# Altium project NucleoClone.PrjPcb
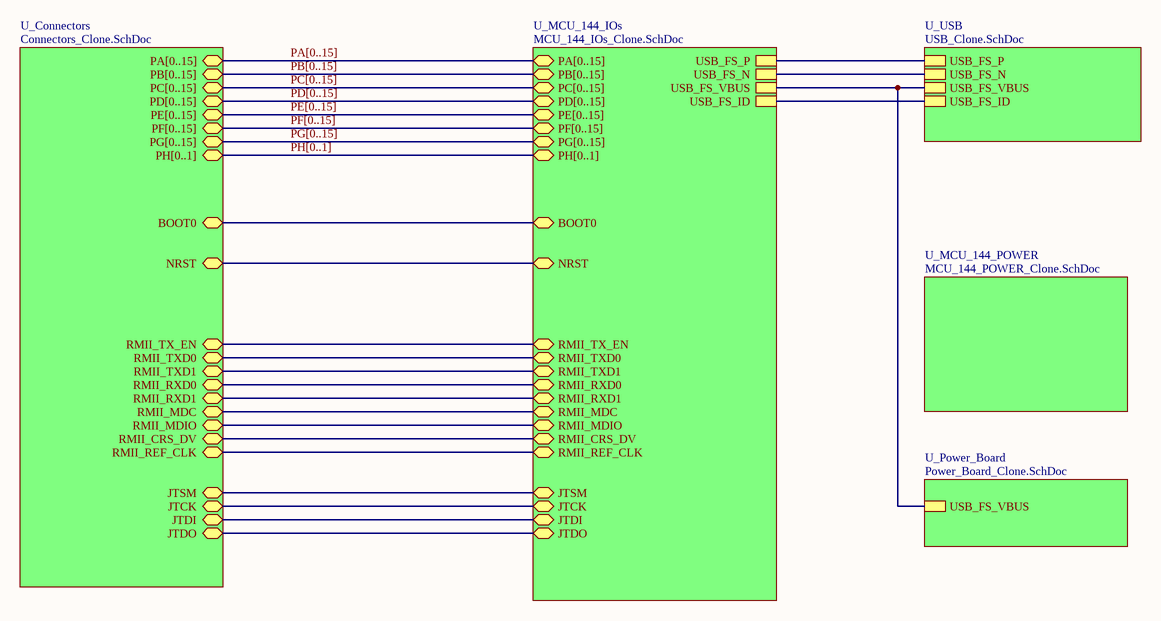
[diagram p0: NucleoClone_Top.SchDoc]
Board_Assembly_Revision: 01; Board_Document_Date: 17-DEC-2018; Board_Name: NUCLEO 144 H7 LEGACY; Board_PCB_Revision: C; Board_Reference: MB1364
6 sheets, 121 parts. Net scope: hierarchical (ports join the sheet entries above them; power ports are global).
Board file: NucleoClone.PcbDoc
Sheets:
  NucleoClone_Top.SchDoc
    U_Connectors = Connectors_Clone.SchDoc
    U_Power_Board = Power_Board_Clone.SchDoc
    U_MCU_144_IOs = MCU_144_IOs_Clone.SchDoc
    U_MCU_144_POWER = MCU_144_POWER_Clone.SchDoc
    U_USB = USB_Clone.SchDoc

## Sheet NucleoClone_Top.SchDoc: mb1319 Top: hierarchical view
size A4; Date: Not used; ApprovedBy: Not used; CheckedBy: Not used; Author: Not used; CompanyName: STMicroelectronics; DrawnBy: Not used; Engineer: Not used; Organization: Not used; Address1: Not used; Address2: Not used; Address3: Not used; Address4: Not used; DocumentNumber: 2; Revision: Not used; SheetNumber: 2; SheetTotal: 9; CurrentTime: Not used; CurrentDate: Not used; Time: Not used; DocumentFullPathAndName: Not used; DocumentName: Not used; ModifiedDate: Not used; ImagePath: Not used; ProjectName: Not used; Application_BuildNumber: Not used

### Sub-sheets
U_Connectors = Connectors_Clone.SchDoc: PA[0..15] (bidir), PB[0..15] (bidir), PC[0..15] (bidir), PD[0..15] (bidir), PE[0..15] (bidir), PH[0..1] (bidir), PF[0..15] (bidir), PG[0..15] (bidir), JTSM (bidir), JTCK (bidir), JTDI (bidir), JTDO (bidir), RMII_TX_EN (bidir), RMII_TXD0 (bidir), RMII_TXD1 (bidir), RMII_RXD0 (bidir), RMII_RXD1 (bidir), RMII_MDC (bidir), RMII_MDIO (bidir), RMII_CRS_DV (bidir), RMII_REF_CLK (bidir), NRST (bidir), BOOT0 (bidir)
U_MCU_144_IOs = MCU_144_IOs_Clone.SchDoc: NRST (bidir), BOOT0 (bidir), RMII_TX_EN (bidir), RMII_MDC (bidir), RMII_TXD0 (bidir), RMII_TXD1 (bidir), RMII_REF_CLK (bidir), RMII_RXD1 (bidir), RMII_MDIO (bidir), RMII_CRS_DV (bidir), RMII_RXD0 (bidir), USB_FS_N, USB_FS_P, USB_FS_VBUS, USB_FS_ID, PA[0..15] (bidir), PB[0..15] (bidir), PC[0..15] (bidir), PD[0..15] (bidir), PE[0..15] (bidir), PH[0..1] (bidir), PG[0..15] (bidir), PF[0..15] (bidir), JTSM (bidir), JTCK (bidir), JTDI (bidir), JTDO (bidir)
U_MCU_144_POWER = MCU_144_POWER_Clone.SchDoc: no entries
U_Power_Board = Power_Board_Clone.SchDoc: USB_FS_VBUS
U_USB = USB_Clone.SchDoc: USB_FS_VBUS, USB_FS_N, USB_FS_P, USB_FS_ID

### Nets
BOOT0: sheet U_Connectors/BOOT0, sheet U_MCU_144_IOs/BOOT0
JTDO: sheet U_Connectors/JTDO, sheet U_MCU_144_IOs/JTDO
NRST: sheet U_Connectors/NRST, sheet U_MCU_144_IOs/NRST
PA13: sheet U_Connectors/JTSM, sheet U_MCU_144_IOs/JTSM
PA14: sheet U_Connectors/JTCK, sheet U_MCU_144_IOs/JTCK
PA15: sheet U_Connectors/JTDI, sheet U_MCU_144_IOs/JTDI
RMII_CRS_DV: sheet U_Connectors/RMII_CRS_DV, sheet U_MCU_144_IOs/RMII_CRS_DV
RMII_MDC: sheet U_Connectors/RMII_MDC, sheet U_MCU_144_IOs/RMII_MDC
RMII_MDIO: sheet U_Connectors/RMII_MDIO, sheet U_MCU_144_IOs/RMII_MDIO
RMII_REF_CLK: sheet U_Connectors/RMII_REF_CLK, sheet U_MCU_144_IOs/RMII_REF_CLK
RMII_RXD0: sheet U_Connectors/RMII_RXD0, sheet U_MCU_144_IOs/RMII_RXD0
RMII_RXD1: sheet U_Connectors/RMII_RXD1, sheet U_MCU_144_IOs/RMII_RXD1
RMII_TX_EN: sheet U_Connectors/RMII_TX_EN, sheet U_MCU_144_IOs/RMII_TX_EN
RMII_TXD0: sheet U_Connectors/RMII_TXD0, sheet U_MCU_144_IOs/RMII_TXD0
RMII_TXD1: sheet U_Connectors/RMII_TXD1, sheet U_MCU_144_IOs/RMII_TXD1
USB_FS_ID: sheet U_MCU_144_IOs/USB_FS_ID, sheet U_USB/USB_FS_ID
USB_FS_N: sheet U_MCU_144_IOs/USB_FS_N, sheet U_USB/USB_FS_N
USB_FS_P: sheet U_MCU_144_IOs/USB_FS_P, sheet U_USB/USB_FS_P
USB_FS_VBUS: sheet U_Power_Board/USB_FS_VBUS, sheet U_MCU_144_IOs/USB_FS_VBUS, sheet U_USB/USB_FS_VBUS

### Buses and harness runs
bus PA[0..15] = sheet U_Connectors/PA[0..15] = sheet U_MCU_144_IOs/PA[0..15]
bus PB[0..15] = sheet U_Connectors/PB[0..15] = sheet U_MCU_144_IOs/PB[0..15]
bus PC[0..15] = sheet U_Connectors/PC[0..15] = sheet U_MCU_144_IOs/PC[0..15]
bus PD[0..15] = sheet U_Connectors/PD[0..15] = sheet U_MCU_144_IOs/PD[0..15]
bus PE[0..15] = sheet U_Connectors/PE[0..15] = sheet U_MCU_144_IOs/PE[0..15]
bus PF[0..15] = sheet U_Connectors/PF[0..15] = sheet U_MCU_144_IOs/PF[0..15]
bus PG[0..15] = sheet U_Connectors/PG[0..15] = sheet U_MCU_144_IOs/PG[0..15]
bus PH[0..1] = sheet U_Connectors/PH[0..1] = sheet U_MCU_144_IOs/PH[0..1]

### Notes on the sheet
- Title:
- Project:
- Size:
- Revision:
- Variant:
- A4
- -
- Date:
- Reference:
- Sheet:
- of

## Sheet Connectors_Clone.SchDoc: Connectors
size A3; Date: Not used; ApprovedBy: Not used; CheckedBy: Not used; Author: Not used; CompanyName: STMicroelectronics; DrawnBy: Not used; Engineer: Not used; Organization: Not used; Address1: Not used; Address2: Not used; Address3: Not used; Address4: Not used; DocumentNumber: 5; Revision: Not used; SheetNumber: 5; SheetTotal: 9; CurrentTime: Not used; CurrentDate: Not used; Time: Not used; DocumentFullPathAndName: Not used; DocumentName: Not used; ModifiedDate: Not used; ImagePath: Not used; ProjectName: Not used; Application_BuildNumber: Not used
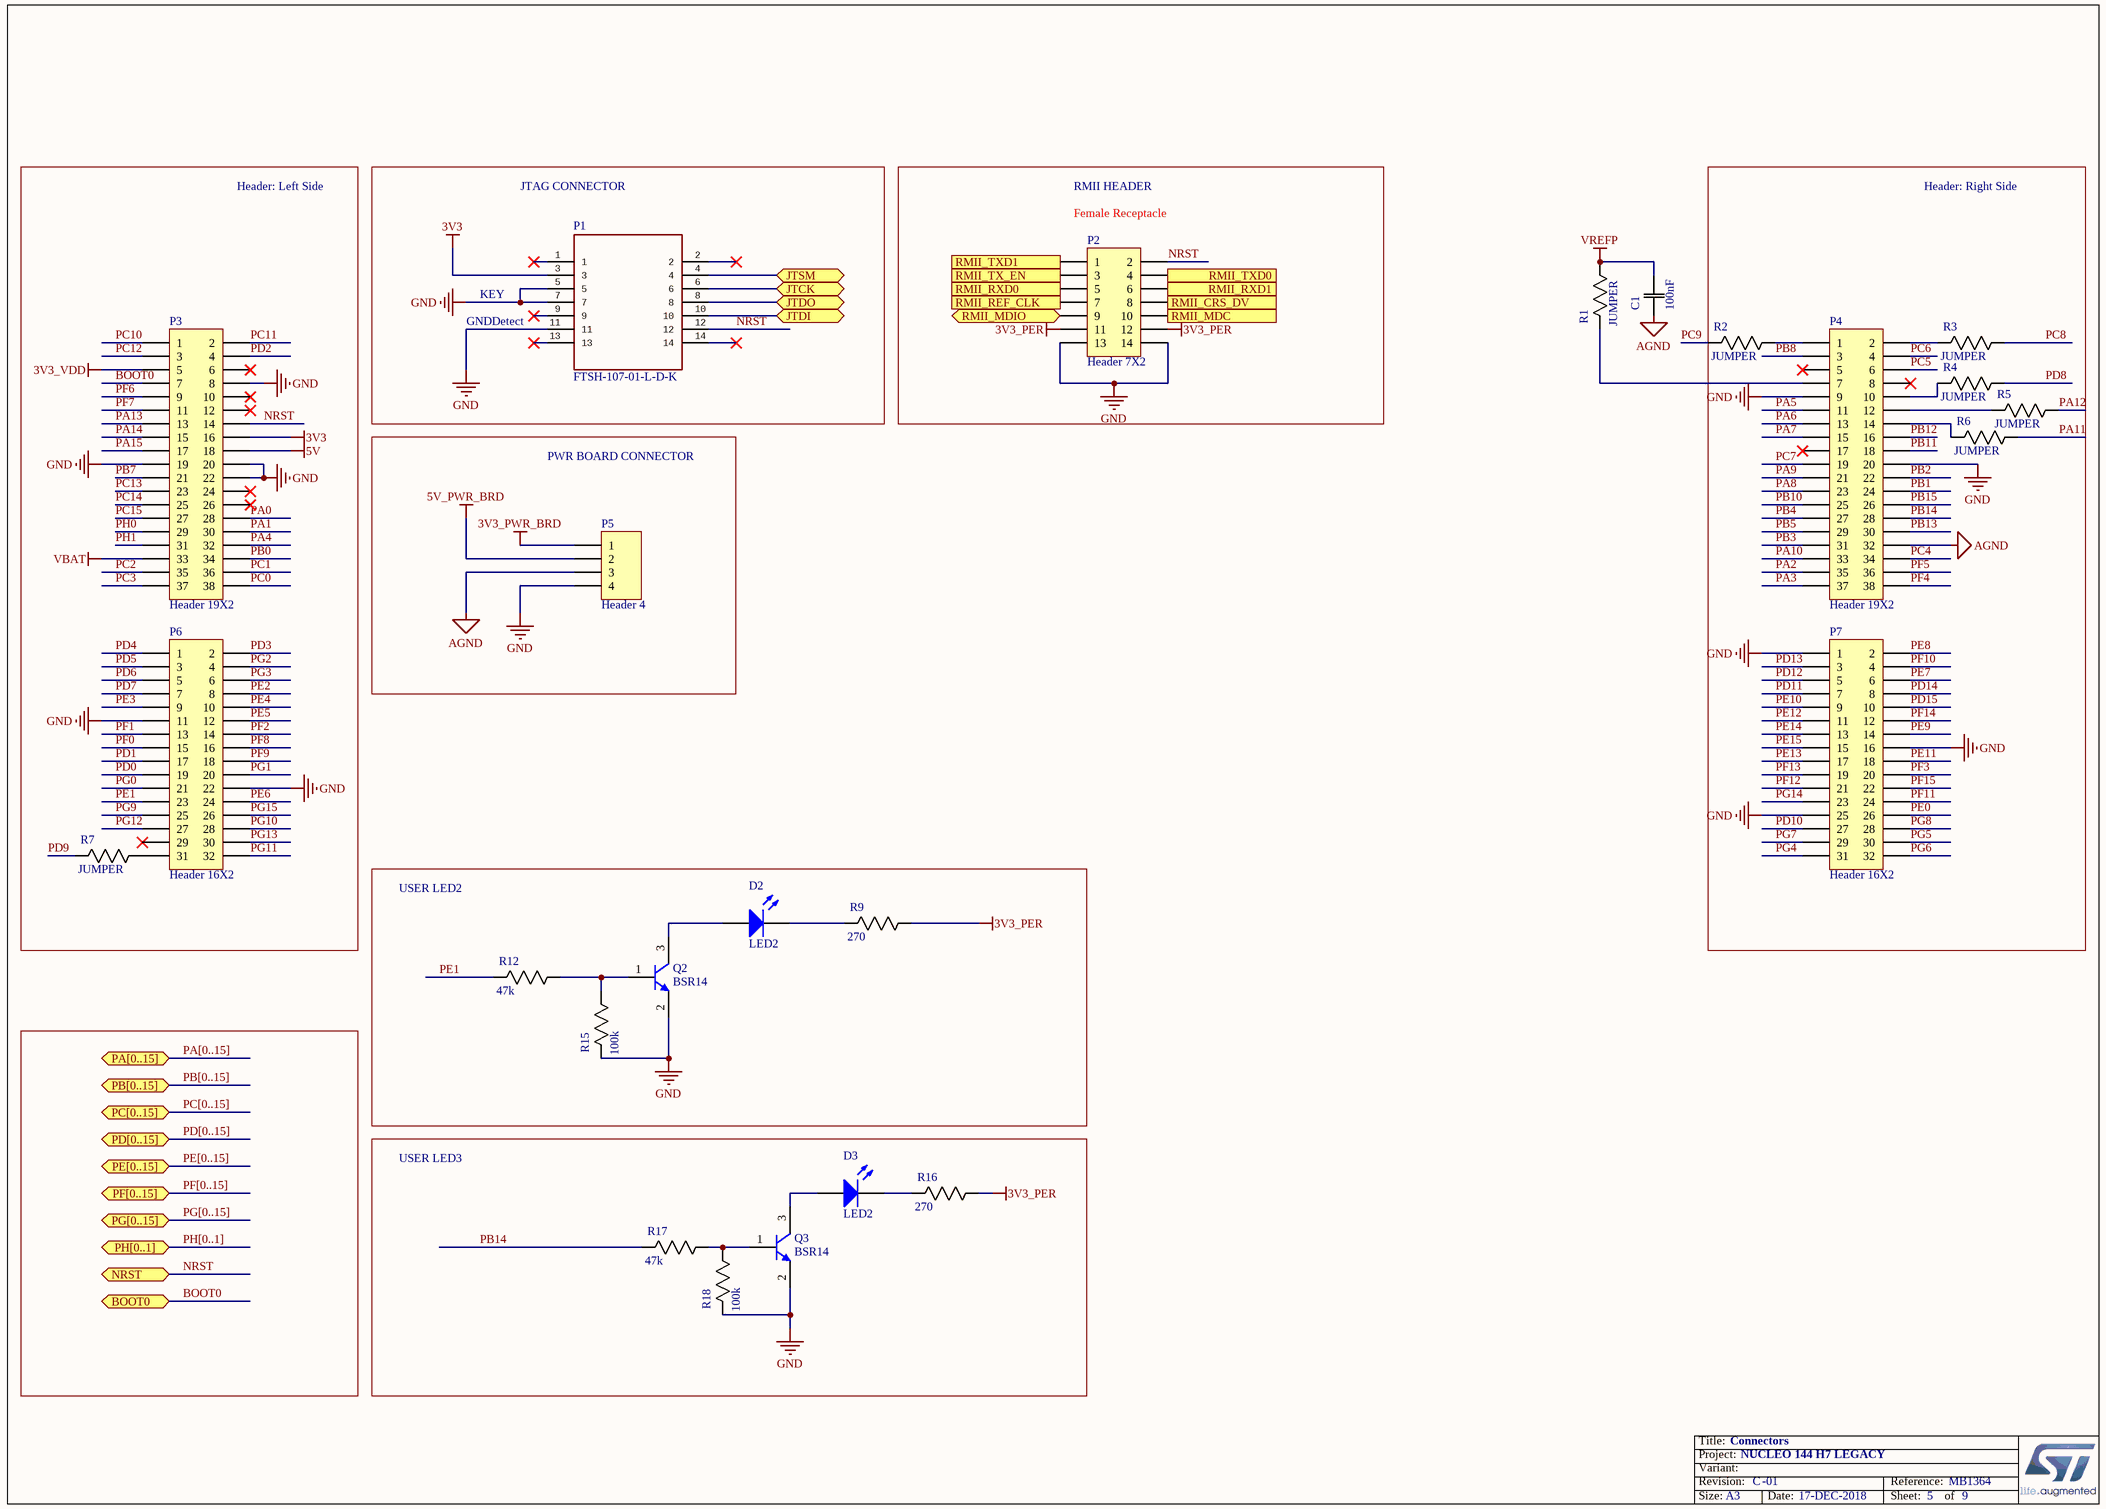
[diagram p1: Connectors_Clone.SchDoc]

### Parts
C1  100nF  [0805]
D2  LED2  [3.2X1.6X1.1]
D3  LED2  [3.2X1.6X1.1]
P1  FTSH-107-01-L-D-K  [CN HDR JTAG]
P2  Header 7X2  [HDR2X7]
P3  Header 19X2  [HDR2X19]
P4  Header 19X2  [HDR2X19]
P5  Header 4  [HDR1X4]
P6  Header 16X2  [HDR2X16]
P7  Header 16X2  [HDR2X16]
Q2  BSR14  [ONSC-SOT-23-3-318-08_V]
Q3  BSR14  [ONSC-SOT-23-3-318-08_V]
R1  JUMPER  [0805]
R2  JUMPER  [0805]
R3  JUMPER  [0805]
R4  JUMPER  [0805]
R5  JUMPER  [0805]
R6  JUMPER  [0805]
R7  JUMPER  [0805]
R9  270  [0805]
R12  47k  [0805]
R15  100k  [0805]
R16  270  [0805]
R17  47k  [0805]
R18  100k  [0805]

### Blocks framed on the sheet
Header: Left Side: P3 P6 R7
Header: Right Side: P4 P7 R2-R6
PWR BOARD CONNECTOR: P5
USER LED2: D2 Q2 R9 R12 R15
USER LED3: D3 Q3 R16-R18

### Ports
BOOT0 (bidir), JTCK (bidir), JTDI (bidir), JTDO (bidir), JTSM (bidir), NRST (bidir), PA[0..15] (bidir), PB[0..15] (bidir), PC[0..15] (bidir), PD[0..15] (bidir), PE[0..15] (bidir), PF[0..15] (bidir), PG[0..15] (bidir), PH[0..1] (bidir), RMII_CRS_DV (out), RMII_MDC (in), RMII_MDIO (bidir), RMII_REF_CLK (in), RMII_RXD0 (out), RMII_RXD1 (out), RMII_TX_EN (in), RMII_TXD0 (in), RMII_TXD1 (in)

### Nets
3V3: P1.3 P3.16
3V3_PER: P2.11 P2.12 R9.1(R1) R16.1(R1)
3V3_PWR_BRD: P5.1
3V3_VDD: P3.5
5V: P3.18
5V_PWR_BRD: P5.2
AGND: C1.1(C1) P4.32 P5.3
GND: P1.5 P1.7 P1.11 P2.13 P2.14 P3.8 P3.19 P3.20 P3.22 P4.9 P4.20 P5.4 P6.11 P6.22 P7.1 P7.16 P7.25 Q2.2(E) Q3.2(E) R15.2(R2) R18.2(R2)
VBAT: P3.33
VREFP: C1.2(C2) R1.1(R1)
BOOT0: P3.7 ; port BOOT0
JTDO: P1.8 ; port JTDO
NRST: P1.12 P2.2 P3.14 ; port NRST
PA0: P3.28
PA1: P3.30
PA2: P4.35
PA3: P4.37
PA4: P3.32
PA5: P4.11
PA6: P4.13
PA7: P4.15
PA8: P4.23
PA9: P4.21
PA10: P4.33
PA11: R6.1(R1)
PA12: R5.1(R1)
PA13: P1.4 P3.13 ; port JTSM
PA14: P1.6 P3.15 ; port JTCK
PA15: P1.10 P3.17 ; port JTDI
PB0: P3.34
PB1: P4.24
PB2: P4.22
PB3: P4.31
PB4: P4.27
PB5: P4.29
PB7: P3.21
PB8: P4.3
PB10: P4.25
PB11: P4.18
PB12: P4.16
PB13: P4.30
PB14: P4.28 R17.2(R2)
PB15: P4.26
PC0: P3.38
PC1: P3.36
PC2: P3.35
PC3: P3.37
PC4: P4.34
PC5: P4.6
PC6: P4.4
PC7: P4.19
PC8: R3.1(R1)
PC9: R2.2(R2)
PC10: P3.1
PC11: P3.2
PC12: P3.3
PC13: P3.23
PC14: P3.25
PC15: P3.27
PD0: P6.19
PD1: P6.17
PD2: P3.4
PD3: P6.2
PD4: P6.1
PD5: P6.3
PD6: P6.5
PD7: P6.7
PD8: R4.1(R1)
PD9: R7.2(R2)
PD10: P7.27
PD11: P7.7
PD12: P7.5
PD13: P7.3
PD14: P7.8
PD15: P7.10
PE0: P7.26
PE1: P6.23 R12.2(R2)
PE2: P6.8
PE3: P6.9
PE4: P6.10
PE5: P6.12
PE6: P6.24
PE7: P7.6
PE8: P7.2
PE9: P7.14
PE10: P7.9
PE11: P7.18
PE12: P7.11
PE13: P7.17
PE14: P7.13
PE15: P7.15
PF0: P6.15
PF1: P6.13
PF2: P6.14
PF3: P7.20
PF4: P4.38
PF5: P4.36
PF6: P3.9
PF7: P3.11
PF8: P6.16
PF9: P6.18
PF10: P7.4
PF11: P7.24
PF12: P7.21
PF13: P7.19
PF14: P7.12
PF15: P7.22
PG0: P6.21
PG1: P6.20
PG2: P6.4
PG3: P6.6
PG4: P7.31
PG5: P7.30
PG6: P7.32
PG7: P7.29
PG8: P7.28
PG9: P6.25
PG10: P6.28
PG11: P6.32
PG12: P6.27
PG13: P6.30
PG14: P7.23
PG15: P6.26
PH0: P3.29
PH1: P3.31
RMII_CRS_DV: P2.8 ; port RMII_CRS_DV
RMII_MDC: P2.10 ; port RMII_MDC
RMII_MDIO: P2.9 ; port RMII_MDIO
RMII_REF_CLK: P2.7 ; port RMII_REF_CLK
RMII_RXD0: P2.5 ; port RMII_RXD0
RMII_RXD1: P2.6 ; port RMII_RXD1
RMII_TX_EN: P2.3 ; port RMII_TX_EN
RMII_TXD0: P2.4 ; port RMII_TXD0
RMII_TXD1: P2.1 ; port RMII_TXD1
NetD2_1: D2.1(A) Q2.3(C)
NetD2_2: D2.2(K) R9.2(R2)
NetD3_1: D3.1(A) Q3.3(C)
NetD3_2: D3.2(K) R16.2(R2)
NetP4_1: P4.1 R2.1(R1)
NetP4_2: P4.2 R3.2(R2)
NetP4_7: P4.7 R1.2(R2)
NetP4_10: P4.10 R4.2(R2)
NetP4_12: P4.12 R5.2(R2)
NetP4_14: P4.14 R6.2(R2)
NetP6_31: P6.31 R7.1(R1)
NetQ2_1: Q2.1(B) R12.1(R1) R15.1(R1)
NetQ3_1: Q3.1(B) R17.1(R1) R18.1(R1)

Not connected (* = marked no-connect by the designer): P1 1* 2* 9* 13* 14*; P3 6* 10* 12* 24* 26*; P4 5* 8* 17*; P6 29*

### Buses and harness runs
bus PA[0..15] = port PA[0..15]
bus PB[0..15] = port PB[0..15]
bus PC[0..15] = port PC[0..15]
bus PD[0..15] = port PD[0..15]
bus PE[0..15] = port PE[0..15]
bus PF[0..15] = port PF[0..15]
bus PG[0..15] = port PG[0..15]
bus PH[0..1] = port PH[0..1]

### Notes on the sheet
- JTAG CONNECTOR
- RMII HEADER
- (near P2) Female Receptacle
- KEY
- (near P1) GNDDetect
- Title:
- Project:
- Size:
- Revision:
- Variant:
- A3
- -
- Date:
- Reference:
- Sheet:
- of

### Library data of the parts
C1 = CAP 100nF 0805: CAP CER 0.1UF 50V X7R 0805; MP: CC0805KRX7R9BB104; MF: Yageo; Tolerance: 10%; Package: 0805; Price: 0,119 CAD; Value: 100nF; Digikey: 311-1140-1-ND; Digikey Link: https://www.digikey.ca/products/en?keywords=311-1140-1-ND; Rating: 50V
D2 = LED GREEN SMD: Typical RED, GREEN, YELLOW, AMBER GaAs LED; MF: Lite-On Inc.; MP: LTST-C191KGKT; Rating: 2V; Digikey: 160-1446-1-ND; Digikey Link: https://www.digikey.ca/products/en?keywords=160-1446-1-ND; Package: 0603
D3 = LED RED SMD: Typical RED, GREEN, YELLOW, AMBER GaAs LED; MF: Lite-On Inc.; MP: LTST-C190CKT; Rating: 1.8V; Digikey: 160-1181-1-ND; Digikey Link: https://www.digikey.ca/products/en?keywords=160-1181-1-ND; Package: 0603
P1 = CN HDR JTAG: Connector Header Through Hole 14 position 0.050" (1.27mm); MF: Samtec Inc.; Rating: 3.4A; ComponentLink1Description: Digikey; ComponentLink1URL: https://www.digikey.ca/product-detail/en/samtec-inc/FTSH-107-01-L-D-K/612-FTSH-107-01-L-D-K-ND/6693516; ComponentLink2Description: Datasheet; ComponentLink2URL: https://www.digikey.ca/en/datasheets/samtecinc/samtec-inc-ftsh-1xx-xx-xx-d-xx-xx-mkt; Digikey: 612-FTSH-107-01-L-D-K-ND; Digikey Link: https://www.digikey.ca/product-detail/en/samtec-inc/FTSH-107-01-L-D-K/612-FTSH-107-01-L-D-K-ND/6693516; MP: FTSH-107-01-L-D-K; Price: 5.14000 CAD
P2 = Header 7X2: Header, 7-Pin, Dual row; LatestRevisionDate: 17-Jul-2002; LatestRevisionNote: Re-released for DXP Platform.; Publisher: Altium Limited
P3 P4 = Header 19X2: Header, 19-Pin, Dual row; LatestRevisionDate: 17-Jul-2002; LatestRevisionNote: Re-released for DXP Platform.; Publisher: Altium Limited
P5 = Header 4: Header, 4-Pin; LatestRevisionDate: 17-Jul-2002; LatestRevisionNote: Re-released for DXP Platform.; Publisher: Altium Limited
P6 P7 = Header 16X2: Header, 16-Pin, Dual row; LatestRevisionDate: 17-Jul-2002; LatestRevisionNote: Re-released for DXP Platform.; Publisher: Altium Limited
Q2 Q3 = CMP-1048-00605-1: Bipolar (BJT) Transistor NPN 40V 800mA 300MHz 350mW Surface Mount SOT-23-3; ComponentLink1Description: Manufacturer URL; ComponentLink3Description: Package Specification; ComponentLink2URL: http://www.onsemi.com/pub_link/Collateral/BSS64LT1-D.PDF; ComponentLink1URL: http://www.onsemi.com/; ComponentLink2Description: Datasheet; ComponentLink3URL: http://www.onsemi.cn/pub_link/Collateral/318-08.PDF; Digikey: BSR14TR-ND
R1-R7 = RES 0 0805: RES SMD 0 OHM JUMPER 1/8W 0805; MP: RC0805JR-070RL; MF: Yageo; Value: 0; Rating: 0.125W; Digikey: 311-0.0ARCT-ND; Price: 0.058 CAD; Package: 0805; Digikey Link: https://www.digikey.ca/products/en?keywords=311-0.0ARCT-ND
R9 R16 = RES 270 0805: RES SMD 270 OHM 5% 1/8W 0805; MP: RC0805JR-07270RL; MF: Yageo; Rating: 0.125W; Digikey: 311-270ARCT-ND; Price: 0.054 CAD; Package: 0805; Value: 270; Digikey Link: https://www.digikey.ca/product-detail/en/yageo/RC0805JR-07270RL/311-270ARCT-ND/731238
R12 R17 = RES 47k 0805: RES SMD 47K OHM 1% 1/8W 0805; MP: RC0805FR-0747KL; MF: Yageo; Rating: 0.125W; Digikey: 311-47.0KCRCT-ND; Price: 0.061 CAD; Package: 0805; Value: 47k; Digikey Link: https://www.digikey.ca/product-detail/en/yageo/RC0805FR-0747KL/311-47.0KCRCT-ND/730920; Tolerance: 1%
R15 R18 = RES 100k 0805: RES SMD 100K OHM 1% 1/8W 0805; MP: RC0805FR-07100KL; MF: Yageo; Rating: 0.125W; Digikey: 311-100KCRCT-ND; Price: 0.058 CAD; Package: 0805; Value: 100k; Digikey Link: https://www.digikey.ca/products/en?keywords=311-100KCRCT-ND; Tolerance: 1%

## Sheet Power_Board_Clone.SchDoc: MAIN POWER 5V / 3V3 / 1V8
size A4; Date: Not used; ApprovedBy: Not used; CheckedBy: Not used; Author: Not used; CompanyName: STMicroelectronics; DrawnBy: Not used; Engineer: Not used; Organization: Not used; Address1: Not used; Address2: Not used; Address3: Not used; Address4: Not used; DocumentNumber: 9; Revision: Not used; SheetNumber: 8; SheetTotal: 9; CurrentTime: Not used; CurrentDate: Not used; Time: Not used; DocumentFullPathAndName: Not used; DocumentName: Not used; ModifiedDate: Not used; ImagePath: Not used; ProjectName: Not used; Application_BuildNumber: Not used
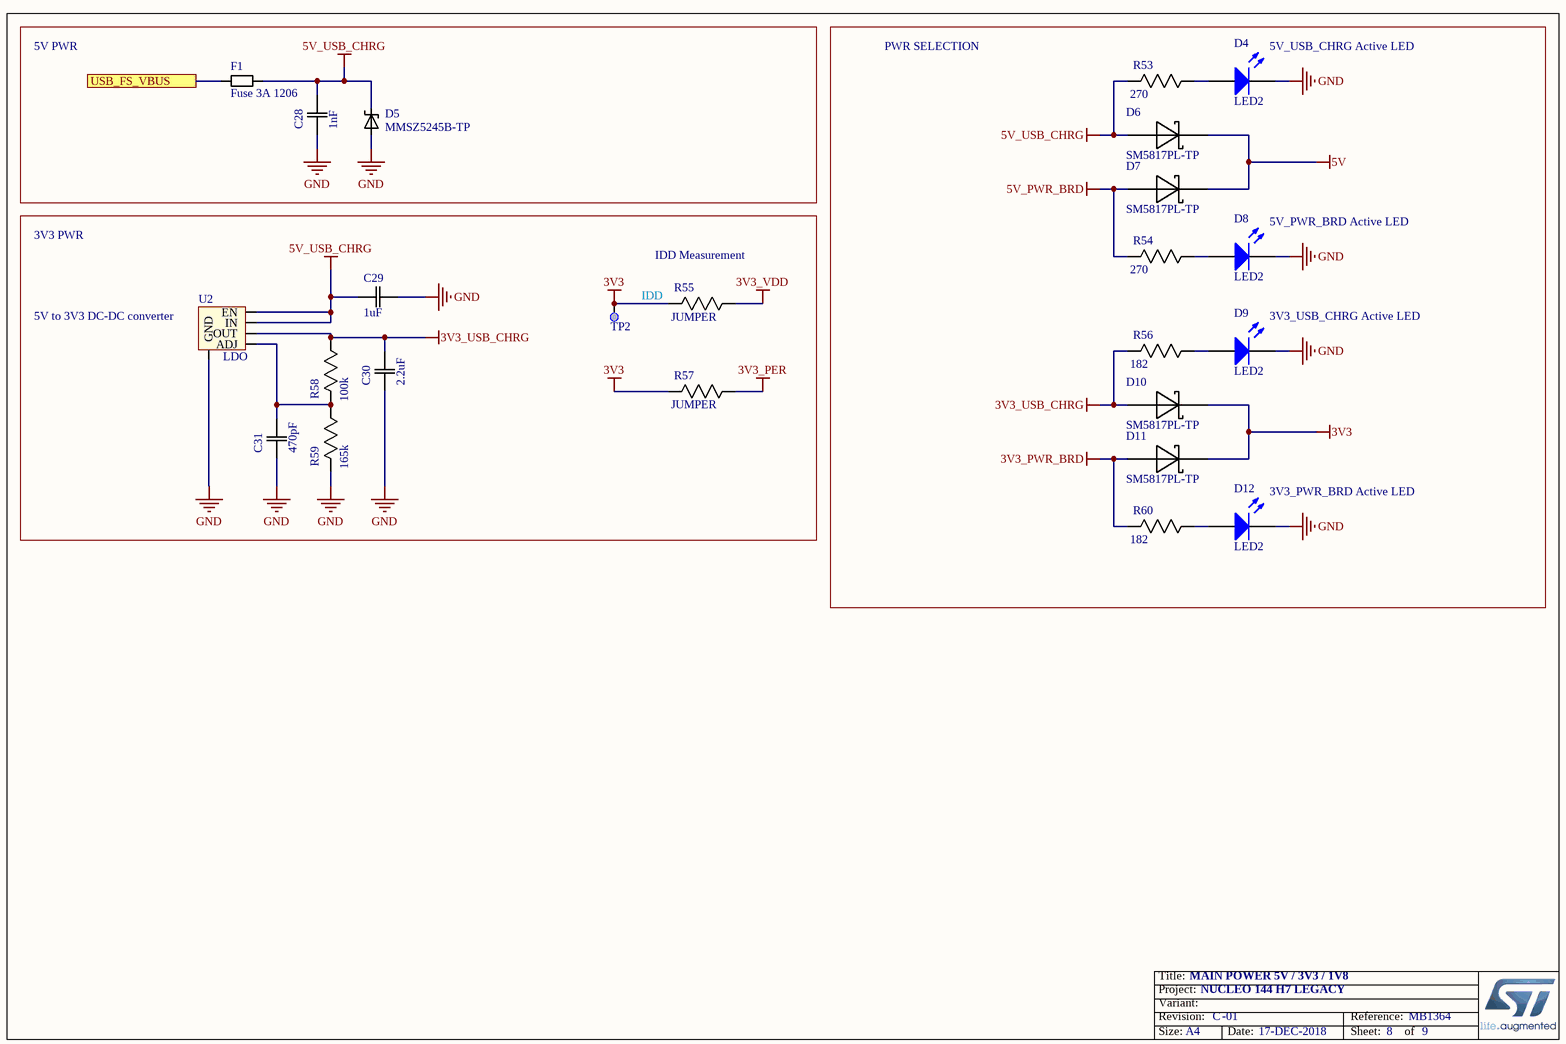
[diagram p2: Power_Board_Clone.SchDoc]

### Parts
C28  1nF  [0805]
C29  1uF  [0805]
C30  2.2uF  [0805]
C31  470pF  [0805]
D4  LED2  [3.2X1.6X1.1]
D5  MMSZ5245B-TP  [SOD-123]
D6  SM5817PL-TP  [SOD-123]
D7  SM5817PL-TP  [SOD-123]
D8  LED2  [3.2X1.6X1.1]
D9  LED2  [3.2X1.6X1.1]
D10  SM5817PL-TP  [SOD-123]
D11  SM5817PL-TP  [SOD-123]
D12  LED2  [3.2X1.6X1.1]
F1  Fuse 3A 1206  [1206]
R53  270  [0805]
R54  270  [0805]
R55  JUMPER  [0805]
R56  182  [0805]
R57  JUMPER  [0805]
R58  100k  [0805]
R59  165k  [0805]
R60  182  [0805]
TP2  Test Point  [TP_SMD_1MM]  (value not drawn)  (no BOM)
U2  LDO  [REG LIN POS ADJ 500MA 8SOIC]

### Blocks framed on the sheet
5V PWR: C28 D5 F1

### Ports
USB_FS_VBUS

### Nets
3V3: D10.C(K) D11.C(K) R55.2(R2) R57.2(R2) TP2.1
3V3_PER: R57.1(R1)
3V3_PWR_BRD: D11.A R60.2(R2)
3V3_USB_CHRG: C30.2(C2) D10.A R56.2(R2) R58.1(R1) U2.OUT
3V3_VDD: R55.1(R1)
5V: D6.C(K) D7.C(K)
5V_PWR_BRD: D7.A R54.2(R2)
5V_USB_CHRG: C28.2(C2) C29.1(C1) D5.C D6.A F1.2 R53.2(R2) U2.EN U2.IN
GND: C28.1(C1) C29.2(C2) C30.1(C1) C31.1(C1) D4.2(K) D5.A D8.2(K) D9.2(K) D12.2(K) R59.2(R2) U2.GND
USB_FS_VBUS: F1.1 ; port USB_FS_VBUS
NetC31_2: C31.2(C2) R58.2(R2) R59.1(R1) U2.ADJ
NetD4_1: D4.1(A) R53.1(R1)
NetD8_1: D8.1(A) R54.1(R1)
NetD9_1: D9.1(A) R56.1(R1)
NetD12_1: D12.1(A) R60.1(R1)

### Notes on the sheet
- PWR SELECTION
- (near D4) 5V_USB_CHRG Active LED
- 3V3 PWR
- (near R55) IDD Measurement
- (near D8) 5V_PWR_BRD Active LED
- (near U2) 5V to 3V3 DC-DC converter
- IDD
- (near D9) 3V3_USB_CHRG Active LED
- (near D12) 3V3_PWR_BRD Active LED
- Title:
- Project:
- Size:
- Revision:
- Variant:
- A4
- -
- Date:
- Reference:
- Sheet:
- of

### Library data of the parts
C28 = CAP 1nF 0805: CAP CER 1000PF 50V X7R 0805; MP: CC0805KRX7R9BB102; MF: Yageo; Tolerance: 10%; Package: 0805; Price: 0.1 CAD; Value: 1nF; Digikey: 311-1127-1-ND; Digikey Link: https://www.digikey.ca/products/en?keywords=311-1127-1-ND; Rating: 50V
C29 = CAP 1uF 0805: CAP CER 1UF 50V X7R 0805; MP: CL21B105KBFNNNE; MF: Samsung Electro-Mechanics; Tolerance: 10%; Package: 0805; Price: 0,172 CAD; Value: 1uF; Digikey: 1276-1029-1-ND; Digikey Link: https://www.digikey.ca/product-detail/en/samsung-electro-mechanics/CL21B105KBFNNNE/1276-1029-1-ND/3889115; Rating: 50V
C30 = CAP 2.2uF 0805: CAP CER 1UF 50V X7R 0805; MP: C0805C225K4RACTU; MF: KEMET; Tolerance: 10%; Rating: 16V; Package: 0805; Price: 0,461 CAD; Value: 2.2uF; Digikey: 399-3523-1-ND; Digikey Link: https://www.digikey.ca/products/en?keywords=399-3523-1-ND
C31 = CAP 470pF 0805: CAP CER 470PF 50V C0G/NPO 0805; MP: CC0805JRNPO9BN471; MF: Yageo; Tolerance: 5%; Package: 0805; Price: 0,135 CAD; Value: 470pF; Digikey: 311-1119-1-ND; Digikey Link: https://www.digikey.ca/products/en?keywords=311-1119-1-ND; Rating: 50V
D4 D8 D9 D12 = LED GREEN SMD: as D2 on sheet Connectors_Clone; Digikey: 160-1446-1-ND; Digikey Link: https://www.digikey.ca/products/en?keywords=160-1446-1-ND; Package: 0603
D5 = MMSZ5245B-TP: Zener Diode 15V 500mW ±5% Surface Mount SOD-123; MP: MMSZ5224BT1G; MF: ON Semiconductor; Price: None; SnapEDA_Link: https://www.snapeda.com/parts/MMSZ5224BT1G/ON%20Semiconductor/view-part/230941/?ref=snap; Package: SOD-123 ON Semiconductor; Availability: Unavailable; Value: *; ComponentLink1Description: digikey; ComponentLink1URL: https://www.digikey.ca/en/products/detail/micro-commercial-co/MMSZ5245B-TP/1793206
D6 D7 D10 D11 = SM5817PL-TP: Diode Schottky 20V 1A Surface Mount SOD-123FL; MF: Micro Commercial Co; ComponentLink1Description: digikey; ComponentLink1URL: https://www.digikey.ca/product-detail/en/on-semiconductor/MBR0540T1G/MBR0540T1GOSCT-ND/917967; Digikey: SM5817PL-TPMSCT-ND; Digikey Link: https://www.digikey.ca/product-detail/en/micro-commercial-co/SM5817PL-TP/SM5817PL-TPMSCT-ND/1793410; MP: SM5817PL-TP; Voltage Rating: 20V; Package: SOD-123; Current Rating: 1A
F1 = Fuse 3A 1206: FUSE 3.0A 63VAC/DC SLOW 1206; MF: Bel Fuse Inc.; MP: 0685T3000-01; Digikey: 507-1896-6-ND; Rating: 3A; Digikey Link: https://www.digikey.ca/product-detail/en/bel-fuse-inc/0685T3000-01/507-1896-6-ND/4968212
R53 R54 = RES 270 0805: as R9 on sheet Connectors_Clone; Digikey: 311-270ARCT-ND; Price: 0.054 CAD; Package: 0805; Value: 270; Digikey Link: https://www.digikey.ca/product-detail/en/yageo/RC0805JR-07270RL/311-270ARCT-ND/731238
R55 R57 = RES 0 0805: as R1 on sheet Connectors_Clone; Digikey: 311-0.0ARCT-ND; Price: 0.058 CAD; Package: 0805; Digikey Link: https://www.digikey.ca/products/en?keywords=311-0.0ARCT-ND
R56 R60 = RES 182 0805: RES SMD 182 OHM 1% 1/8W 0805; MP: ERJ-6ENF1820V; MF: Panasonic Electronic Components; Rating: 0.125W; Digikey: P182CCT-ND; Price: 0.15 CAD; Package: 0805; Value: 182; Digikey Link: https://www.digikey.ca/product-detail/en/panasonic-electronic-components/ERJ-6ENF1820V/P182CCT-ND/118743; Tolerance: 1%
R58 = RES 100k 0805: as R15 on sheet Connectors_Clone; Digikey: 311-100KCRCT-ND; Price: 0.058 CAD; Package: 0805; Value: 100k; Digikey Link: https://www.digikey.ca/products/en?keywords=311-100KCRCT-ND; Tolerance: 1%
R59 = RES 165k 0805: 165 kOhms ±1% 0.25W, 1/4W Chip Resistor 0805 (2012 Metric) Automotive AEC-Q200, Moisture Resistant Thick Film; MP: RK73H2ATTD1653F; MF: KOA Speer Electronics, Inc.; Digikey: 2019-RK73H2ATTD1653FCT-ND; Price: 0.15 CAD; Package: 0805; Value: 165k; Rating: 0.25W; Digikey Link: https://www.digikey.ca/product-detail/en/koa-speer-electronics-inc/RK73H2ATTD1653F/2019-RK73H2ATTD1653FCT-ND/10235747
TP2 = MCD-00074: Test Point 1mm; Part_Type: Mechanical; Internal_Part_Number: MCD-00074; Provided_By: n/a; Status: Released; ComponentLink1Description: Datasheet; ComponentLink1URL: http://na; Manufacturer: n/a; Manufacturer_Part_Number: n/a; ECCN_US: n/a; ECCN_EU: n/a
U2 = REG LIN POS ADJ: Linear Voltage Regulator IC  1 Output  500mA 8-SOIC; MF: Texas Instruments; MP: TL5209DR; Digikey: 296-21569-1-ND; Digikey Link: https://www.digikey.ca/product-detail/en/texas-instruments/TL5209DR/296-21569-1-ND/1427137; Price: 1.548 CAD; Rating: 500mA; Package: 8 SOIC

## Sheet MCU_144_IOs_Clone.SchDoc: MCU 144 I/Os
size A3; Date: Not used; ApprovedBy: Not used; CheckedBy: Not used; Author: Not used; CompanyName: STMicroelectronics; DrawnBy: Not used; Engineer: Not used; Organization: Not used; Address1: Not used; Address2: Not used; Address3: Not used; Address4: Not used; DocumentNumber: 3; Revision: Not used; SheetNumber: 3; SheetTotal: 9; CurrentTime: Not used; CurrentDate: Not used; Time: Not used; DocumentFullPathAndName: Not used; DocumentName: Not used; ModifiedDate: Not used; ImagePath: Not used; ProjectName: Not used; Application_BuildNumber: Not used
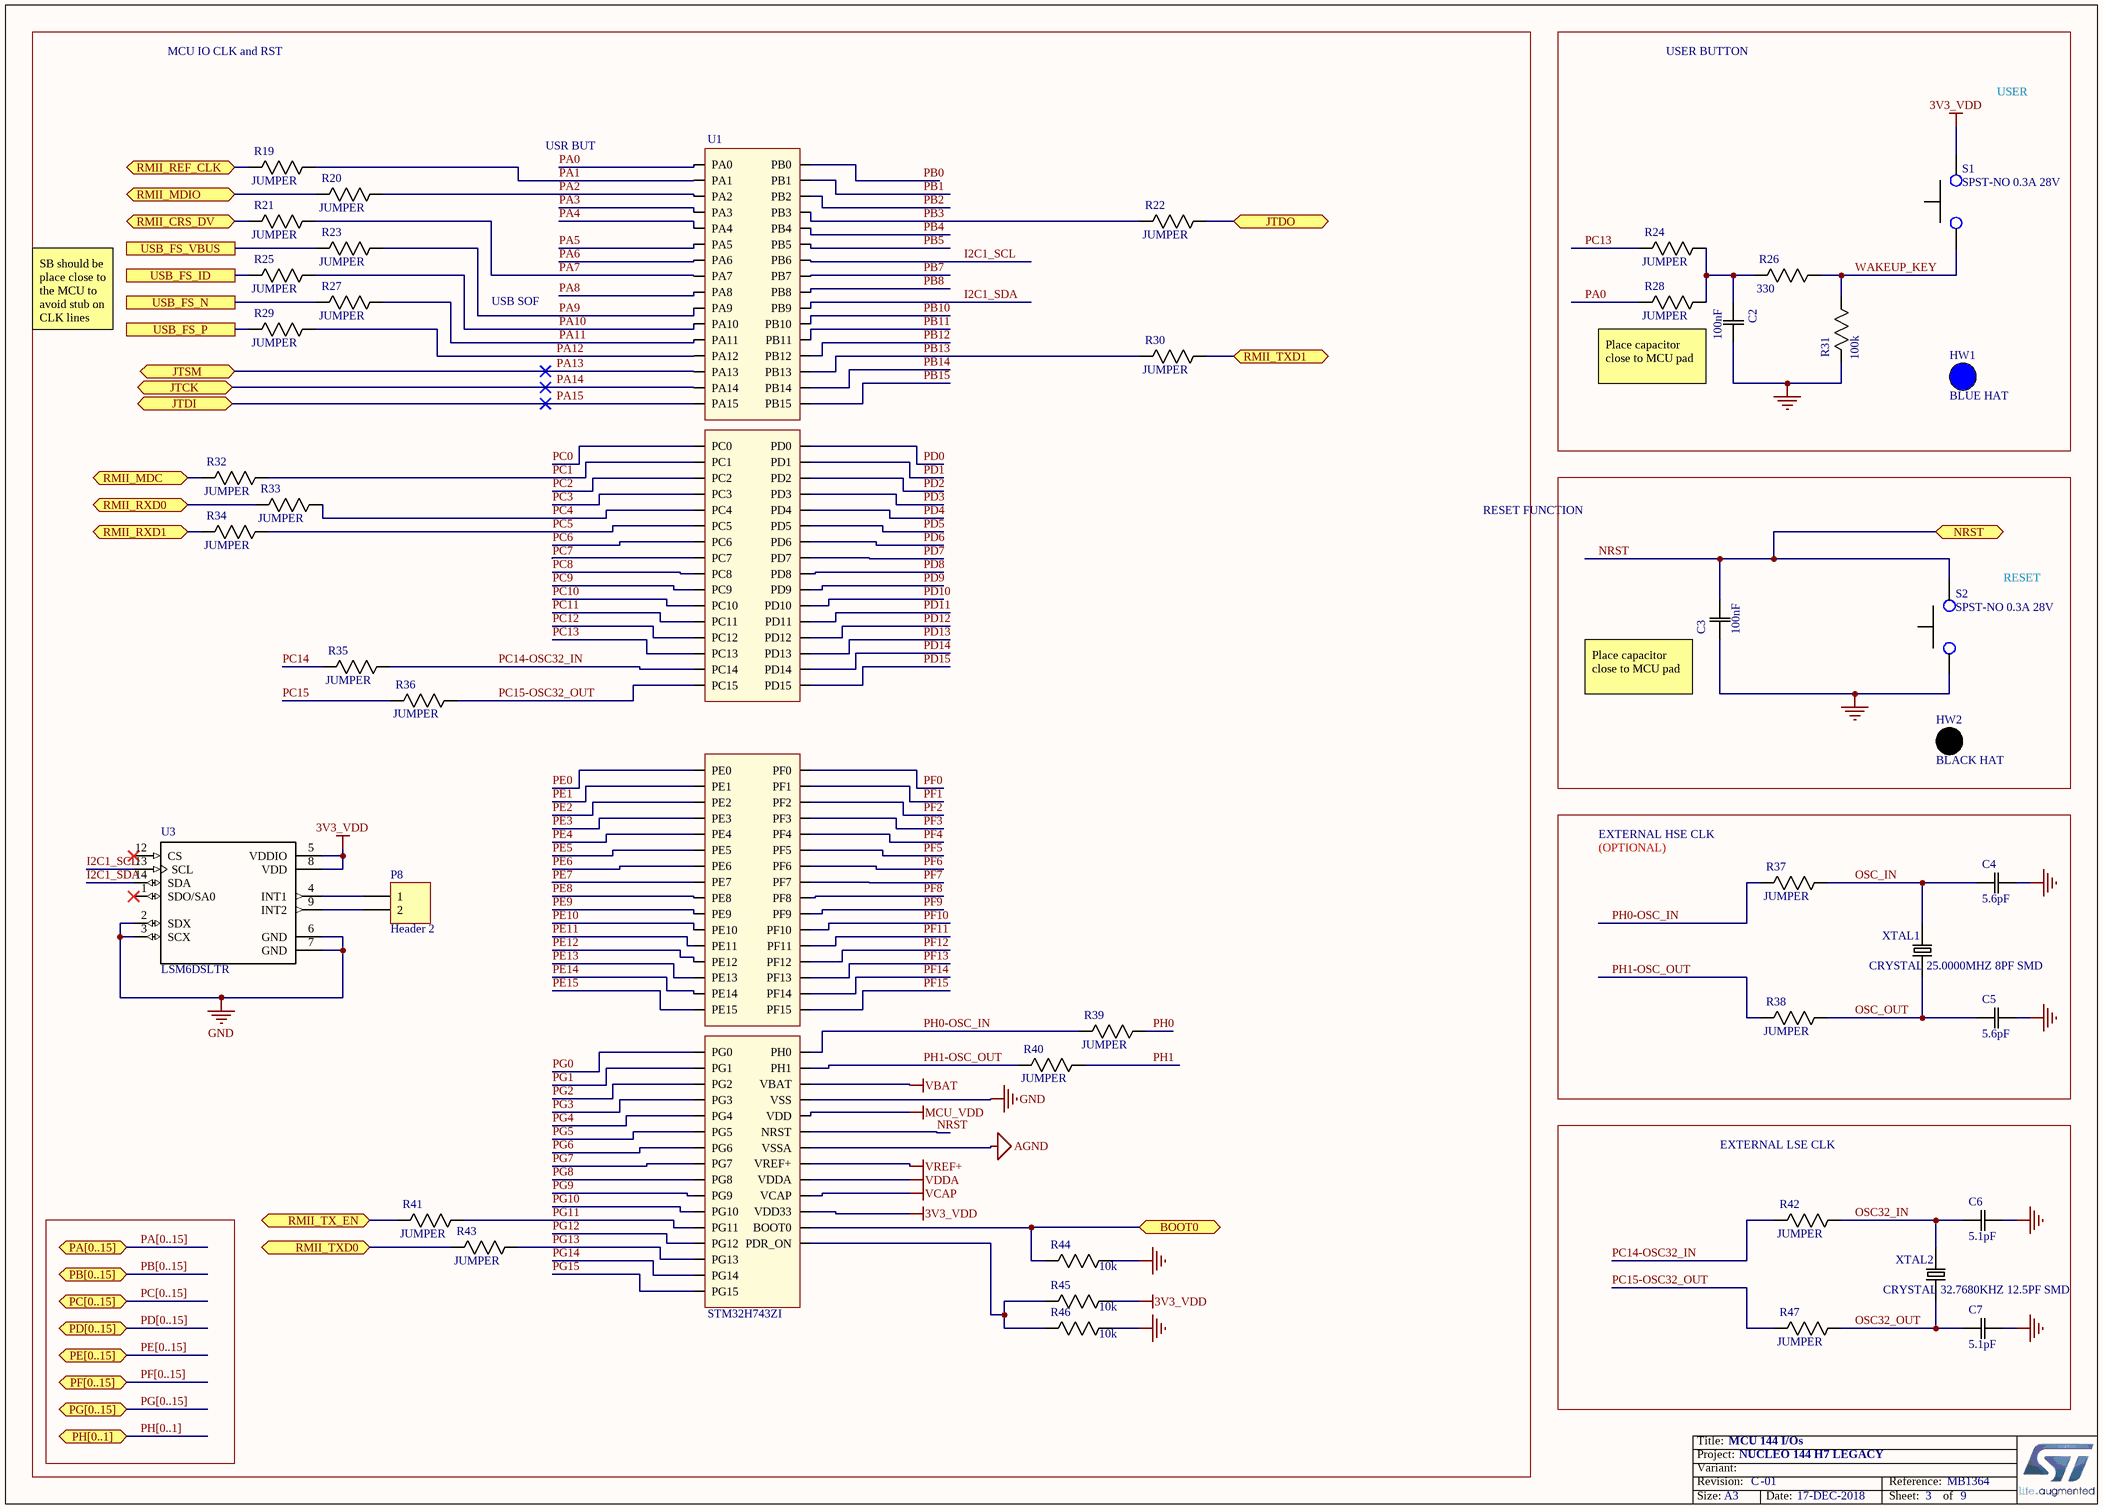
[diagram p3: MCU_144_IOs_Clone.SchDoc]

### Parts
(Parts that share a designator on the sheet are numbered #1, #2 ... from top to bottom, then left to right.)
C2  100nF  [0805]
C3  100nF  [0805]
C4  5.6pF  [0805]
C5  5.6pF  [0805]
C6  5.1pF  [0805]
C7  5.1pF  [0805]
HW1  value BLUE HAT  (hidden comment: BUTTON_HAT_BLUE)  (mechanical)
HW2  value BLACK HAT  (hidden comment: BUTTON_HAT_BLACK)  (mechanical)
P8#1  Header 2  [HDR1X2]
R19  JUMPER  [0805]
R20  JUMPER  [0805]
R21  JUMPER  [0805]
R22  JUMPER  [0805]
R23  JUMPER  [0805]
R24  JUMPER  [0805]
R25  JUMPER  [0805]
R26  330  [0805]
R27  JUMPER  [0805]
R28  JUMPER  [0805]
R29  JUMPER  [0805]
R30  JUMPER  [0805]
R31  100k  [0805]
R32  JUMPER  [0805]
R33  JUMPER  [0805]
R34  JUMPER  [0805]
R35  JUMPER  [0805]
R36  JUMPER  [0805]
R37  JUMPER  [0805]
R38  JUMPER  [0805]
R39  JUMPER  [0805]
R40  JUMPER  [0805]
R41  JUMPER  [0805]
R42  JUMPER  [0805]
R43  JUMPER  [0805]
R44  10k  [0805]
R45  10k  [0805]
R46  10k  [0805]
R47  JUMPER  [0805]
S1  SPST-NO 0.3A 28V  [PB300STQ]
S2  SPST-NO 0.3A 28V  [PB300STQ]
U1  STM32H743ZI  [STM32H7]
U3  LSM6DSLTR  [LGA-14]
XTAL1  CRYSTAL 25.0000MHZ 8PF SMD  [SMD-2]
XTAL2  CRYSTAL 32.7680KHZ 12.5PF SMD  [SMD-2]

### Blocks framed on the sheet
EXTERNAL LSE CLK: C6 C7 R42 R47 XTAL2

### Ports
BOOT0 (bidir), JTCK (bidir), JTDI (bidir), JTDO (bidir), JTSM (bidir), NRST (bidir), PA[0..15] (bidir), PB[0..15] (bidir), PC[0..15] (bidir), PD[0..15] (bidir), PE[0..15] (bidir), PF[0..15] (bidir), PG[0..15] (bidir), PH[0..1] (bidir), RMII_CRS_DV (bidir), RMII_MDC (bidir), RMII_MDIO (bidir), RMII_REF_CLK (bidir), RMII_RXD0 (bidir), RMII_RXD1 (bidir), RMII_TX_EN (bidir), RMII_TXD0 (bidir), RMII_TXD1 (bidir), USB_FS_ID, USB_FS_N, USB_FS_P, USB_FS_VBUS

### Nets
3V3_VDD: R45.1(R1) S1.2 U1.VDD33USB(VDD33) U3.5(VDDIO) U3.8(VDD)
AGND: U1.VSSA
GND: C2.2(C2) C3.1(C1) C4.2(C2) C5.2(C2) C6.2(C2) C7.2(C2) R31.2(R2) R44.1(R1) R46.1(R1) S2.1 U1.VSS U3.2(SDX) U3.3(SCX) U3.6(GND) U3.7(GND)
MCU_VDD: U1.VDD
VBAT: U1.VBAT
VCAP: U1.VCAP
VDDA: U1.VDDA
VREF+: U1.VREF+
BOOT0: R44.2(R2) U1.BOOT0 ; port BOOT0
I2C1_SCL: U1.PB6 U3.13(SCL)
I2C1_SDA: U1.PB9 U3.14(SDA)
JTDO: R22.1(R1) ; port JTDO
NRST: C3.2(C2) S2.2 U1.NRST ; port NRST
OSC32_IN: C6.1(C1) R42.1(R1) XTAL2.2
OSC32_OUT: C7.1(C1) R47.1(R1) XTAL2.1
OSC_IN: C4.1(C1) R37.1(R1) XTAL1.2
OSC_OUT: C5.1(C1) R38.1(R1) XTAL1.1
PA0: R28.2(R2) U1.PA0
PA1: R19.1(R1) U1.PA1
PA2: R20.1(R1) U1.PA2
PA3: U1.PA3
PA4: U1.PA4
PA5: U1.PA5
PA6: U1.PA6
PA7: R21.1(R1) U1.PA7
PA8: U1.PA8
PA9: R23.1(R1) U1.PA9
PA10: R25.1(R1) U1.PA10
PA11: R27.1(R1) U1.PA11
PA12: R29.1(R1) U1.PA12
PA13: U1.PA13 ; port JTSM
PA14: U1.PA14 ; port JTCK
PA15: U1.PA15 ; port JTDI
PB0: U1.PB0
PB1: U1.PB1
PB2: U1.PB2
PB3: R22.2(R2) U1.PB3
PB4: U1.PB4
PB5: U1.PB5
PB7: U1.PB7
PB8: U1.PB8
PB10: U1.PB10
PB11: U1.PB11
PB12: U1.PB12
PB13: R30.2(R2) U1.PB13
PB14: U1.PB14
PB15: U1.PB15
PC0: U1.PC0
PC1: R32.1(R1) U1.PC1
PC2: U1.PC2
PC3: U1.PC3
PC4: R33.1(R1) U1.PC4
PC5: R34.1(R1) U1.PC5
PC6: U1.PC6
PC7: U1.PC7
PC8: U1.PC8
PC9: U1.PC9
PC10: U1.PC10
PC11: U1.PC11
PC12: U1.PC12
PC13: R24.2(R2) U1.PC13
PC14: R35.2(R2)
PC14-OSC32_IN: R35.1(R1) R42.2(R2) U1.PC14
PC15: R36.2(R2)
PC15-OSC32_OUT: R36.1(R1) R47.2(R2) U1.PC15
PD0: U1.PD0
PD1: U1.PD1
PD2: U1.PD2
PD3: U1.PD3
PD4: U1.PD4
PD5: U1.PD5
PD6: U1.PD6
PD7: U1.PD7
PD8: U1.PD8
PD9: U1.PD9
PD10: U1.PD10
PD11: U1.PD11
PD12: U1.PD12
PD13: U1.PD13
PD14: U1.PD14
PD15: U1.PD15
PE0: U1.PE0
PE1: U1.PE1
PE2: U1.PE2
PE3: U1.PE3
PE4: U1.PE4
PE5: U1.PE5
PE6: U1.PE6
PE7: U1.PE7
PE8: U1.PE8
PE9: U1.PE9
PE10: U1.PE10
PE11: U1.PE11
PE12: U1.PE12
PE13: U1.PE13
PE14: U1.PE14
PE15: U1.PE15
PF0: U1.PF0
PF1: U1.PF1
PF2: U1.PF2
PF3: U1.PF3
PF4: U1.PF4
PF5: U1.PF5
PF6: U1.PF6
PF7: U1.PF7
PF8: U1.PF8
PF9: U1.PF9
PF10: U1.PF10
PF11: U1.PF11
PF12: U1.PF12
PF13: U1.PF13
PF14: U1.PF14
PF15: U1.PF15
PG0: U1.PG0
PG1: U1.PG1
PG2: U1.PG2
PG3: U1.PG3
PG4: U1.PG4
PG5: U1.PG5
PG6: U1.PG6
PG7: U1.PG7
PG8: U1.PG8
PG9: U1.PG9
PG10: U1.PG10
PG11: R41.1(R1) U1.PG11
PG12: U1.PG12
PG13: R43.1(R1) U1.PG13
PG14: U1.PG14
PG15: U1.PG15
PH0: R39.1(R1)
PH0-OSC_IN: R37.2(R2) R39.2(R2) U1.PH0
PH1: R40.1(R1)
PH1-OSC_OUT: R38.2(R2) R40.2(R2) U1.PH1
RMII_CRS_DV: R21.2(R2) ; port RMII_CRS_DV
RMII_MDC: R32.2(R2) ; port RMII_MDC
RMII_MDIO: R20.2(R2) ; port RMII_MDIO
RMII_REF_CLK: R19.2(R2) ; port RMII_REF_CLK
RMII_RXD0: R33.2(R2) ; port RMII_RXD0
RMII_RXD1: R34.2(R2) ; port RMII_RXD1
RMII_TX_EN: R41.2(R2) ; port RMII_TX_EN
RMII_TXD0: R43.2(R2) ; port RMII_TXD0
RMII_TXD1: R30.1(R1) ; port RMII_TXD1
USB_FS_ID: R25.2(R2) ; port USB_FS_ID
USB_FS_N: R27.2(R2) ; port USB_FS_N
USB_FS_P: R29.2(R2) ; port USB_FS_P
USB_FS_VBUS: R23.2(R2) ; port USB_FS_VBUS
WAKEUP_KEY: R26.1(R1) R31.1(R1) S1.1
NetC2_1: C2.1(C1) R24.1(R1) R26.2(R2) R28.1(R1)
NetP8#1_1: P8#1.1 U3.4(INT1)
NetP8#1_2: P8#1.2 U3.9(INT2)
NetR45_2: R45.2(R2) R46.2(R2) U1.PDR_ON

Not connected (* = marked no-connect by the designer): U3 1(SDO/SA0)* 12(CS)*

### Buses and harness runs
bus PA[0..15] = port PA[0..15]
bus PB[0..15] = port PB[0..15]
bus PC[0..15] = port PC[0..15]
bus PD[0..15] = port PD[0..15]
bus PE[0..15] = port PE[0..15]
bus PF[0..15] = port PF[0..15]
bus PG[0..15] = port PG[0..15]
bus PH[0..1] = port PH[0..1]

### Notes on the sheet
- MCU IO CLK and RST
- USER BUTTON
- USER
- USR BUT
- USB SOF
- SB should be place close to the MCU to avoid stub on CLK lines
- Place capacitor close to MCU pad
- RESET FUNCTION
- RESET
- (near C3) Place capacitor close to MCU pad
- EXTERNAL HSE CLK
- (OPTIONAL)
- Title:
- Project:
- Size:
- Revision:
- Variant:
- A3
- -
- Date:
- Reference:
- Sheet:
- of

### Library data of the parts
C2 C3 = CAP 100nF 0805: as C1 on sheet Connectors_Clone; Package: 0805; Price: 0,119 CAD; Value: 100nF; Digikey: 311-1140-1-ND; Digikey Link: https://www.digikey.ca/products/en?keywords=311-1140-1-ND; Rating: 50V
C4 C5 = CAP 5.6pF 0805: CAP CER 5.6PF 50V C0G/NP0 0805; MP: C0805C569D5GACTU; MF: KEMET; Tolerance: 5%; Package: 0805; Price: 0,249 CAD; Value: 5.6pF; Digikey: 399-9261-1-ND; Digikey Link: https://www.digikey.ca/product-detail/en/kemet/C0805C569D5GACTU/399-9261-1-ND/3522779; Rating: 50V
C6 C7 = CAP 5.1pF 0805: CAP CER 5.1PF 630V NP0 0805; MP: C0805C519KBGAC7800; MF: KEMET; Tolerance: 10%; Rating: 50V; Package: 0805; Price: 0,493 CAD; Value: 5.1pF; Digikey: 399-16524-1-ND; Digikey Link: https://www.digikey.ca/product-detail/en/kemet/C0805C519KBGAC7800/399-16524-1-ND/7917337
HW1 = MCD-00634: Blue Hat for switch TD0341X-G01-BLU; Part_Type: Mechanical; Manufacturer_Part_Number: 988.16.09.3.00002_SH-517; Manufacturer: JIUBABA; Provided_By: SUBCO; Internal_Part_Number: MCD-00634; Status: Released; ComponentLink1Description: Datasheet; ComponentLink1URL: http://tunmcdsvn.tun.st.com/Component_Datasheet_Library/Trunk/Mechanical/Jiubaba_HAT_SH-517; ECCN_US: n/a; ECCN_EU: n/a
HW2 = MCD-00635: Black Hat for switch TD0341X-G01-BLA; Part_Type: Mechanical; Manufacturer_Part_Number: 988.16.09.3.00003_SH-517; Manufacturer: JIUBABA; Provided_By: SUBCO; Internal_Part_Number: MCD-00635; Status: Released; ComponentLink1Description: Datasheet; ComponentLink1URL: http://tunmcdsvn.tun.st.com/Component_Datasheet_Library/Trunk/Mechanical/Jiubaba_HAT_SH-517; ECCN_US: n/a; ECCN_EU: n/a
P8#1 = Header 2: Header, 2-Pin; LatestRevisionDate: 17-Jul-2002; LatestRevisionNote: Re-released for DXP Platform.; Publisher: Altium Limited
R19-R25 R27-R30 R32-R43 R47 = RES 0 0805: as R1 on sheet Connectors_Clone; Digikey: 311-0.0ARCT-ND; Price: 0.058 CAD; Package: 0805; Digikey Link: https://www.digikey.ca/products/en?keywords=311-0.0ARCT-ND
R26 = RES 330 0805: RES SMD 330 OHM 1% 1/8W 0805; MP: RC0805FR-07330RL; MF: Yageo; Rating: 0.125W; Digikey: 311-330CRCT-ND; Price: 0.061 CAD; Package: 0805; Value: 330; Digikey Link: https://www.digikey.ca/products/en?keywords=311-330CRCT-ND
R31 = RES 100k 0805: as R15 on sheet Connectors_Clone; Digikey: 311-100KCRCT-ND; Price: 0.058 CAD; Package: 0805; Value: 100k; Digikey Link: https://www.digikey.ca/products/en?keywords=311-100KCRCT-ND; Tolerance: 1%
R44-R46 = RES 10k 0805: RES SMD 10K OHM 1% 1/8W 0805; MP: RC0805FR-0710KL; MF: Yageo; Rating: 0.125W; Digikey: 311-10.0KCRCT-ND; Price: 0.061 CAD; Package: 0805; Value: 10k; Digikey Link: https://www.digikey.ca/products/en?keywords=311-10.0KCRCT-ND; Tolerance: 1%
S1 S2 = SW PUSH NO: Pushbutton Switch SPST-NO Standard Through Hole; MF: E-Switch; Rating: 28V 0.3A; ComponentLink1Description: Digikey; ComponentLink1URL: https://www.digikey.ca/product-detail/en/e-switch/PB300STQ/EG5398-ND/6126493; ComponentLink2Description: Datasheet; ComponentLink2URL: https://sten-eswitch-13110800-production.s3.amazonaws.com/system/asset/product_line/data_sheet/222/PB300.pdf; Digikey: EG5398-ND; Digikey Link: https://www.digikey.ca/product-detail/en/e-switch/PB300STQ/EG5398-ND/6126493; MP: PB300STQ; Price: 3.40000 CAD
U1 = STM32H743ZI: MF: STMicroelectronics; MP: STM32H743ZIT6; Digikey: 497-17721-ND; Digikey Link: https://www.digikey.ca/product-detail/en/stmicroelectronics/STM32H743ZIT6/497-17721-ND/7809238; Package: 144-LQFP (20x20)
U3 = LSM6DSLTR: Accelerometer, Gyroscope, Temperature, 6 Axis Sensor IÂ²C, SPI Output; MF: STMicroelectronics; SnapEDA_Link: https://www.snapeda.com/parts/LSM6DSLTR/STMicroelectronics/view-part/550517/?ref=snap; Price: None; Availability: Unavailable; MP: LSM6DSLTR; Package: LGA-14 STMicroelectronics; Value: *
XTAL1 = XTAL 25MHZ 8PF SMD: 25MHz ±50ppm Crystal 8pF 70 Ohms 2-SMD, No Lead; MP: NX5032GA-25.000000MHZ-LN-CD-1; MF: NDK America, Inc.; ESR: 70 Ohms; Package: 2-SMD, No Lead; Price: 0.95 CAD; Frequency: 25MHz; Digikey: 644-1041-1-ND; Digikey Link: https://www.digikey.ca/product-detail/en/ndk-america-inc/NX5032GA-25.000000MHZ-LN-CD-1/644-1041-1-ND/1128913; Load Capacitance: 8pF
XTAL2 = XTAL 32.7680KHZ 12.5PF SMD: 32.768kHz ±20ppm Crystal 12.5pF 70 kOhms 2-SMD, No Lead; MP: NX3215SA-32.768K-STD-MUA-8; MF: NDK America, Inc.; Package: 2-SMD, No Lead; Price: 1.04000 CAD; Frequency: 32.768kHz; Digikey: 644-1156-1-ND; Digikey Link: https://www.digikey.ca/en/products/detail/ndk-america-inc/NX3215SA-32-768K-STD-MUA-8/2261469?s=N4IgTCBcDaIGwBYEFoCMqCsc3IHIBEQBdAXyA; Load Capacitance: 12.5pF; ESR: 70 kOhms; ComponentLink1Description: Digikey; ComponentLink1URL: https://www.digikey.ca/en/products/detail/ndk-america-inc/NX3215SA-32-768K-STD-MUA-8/2261469; ComponentLink2Description: Datasheet; ComponentLink2URL: https://media.digikey.com/datasheets/production/702868/1/NX3215SA-32-768K-STD-MUA-8.html

## Sheet MCU_144_POWER_Clone.SchDoc: MCU 144 POWER
size A4; Date: Not used; ApprovedBy: Not used; CheckedBy: Not used; Author: Not used; CompanyName: STMicroelectronics; DrawnBy: Not used; Engineer: Not used; Organization: Not used; Address1: Not used; Address2: Not used; Address3: Not used; Address4: Not used; DocumentNumber: 4; Revision: Not used; SheetNumber: 4; SheetTotal: 9; CurrentTime: Not used; CurrentDate: Not used; Time: Not used; DocumentFullPathAndName: Not used; DocumentName: Not used; ModifiedDate: Not used; ImagePath: Not used; ProjectName: Not used; Application_BuildNumber: Not used
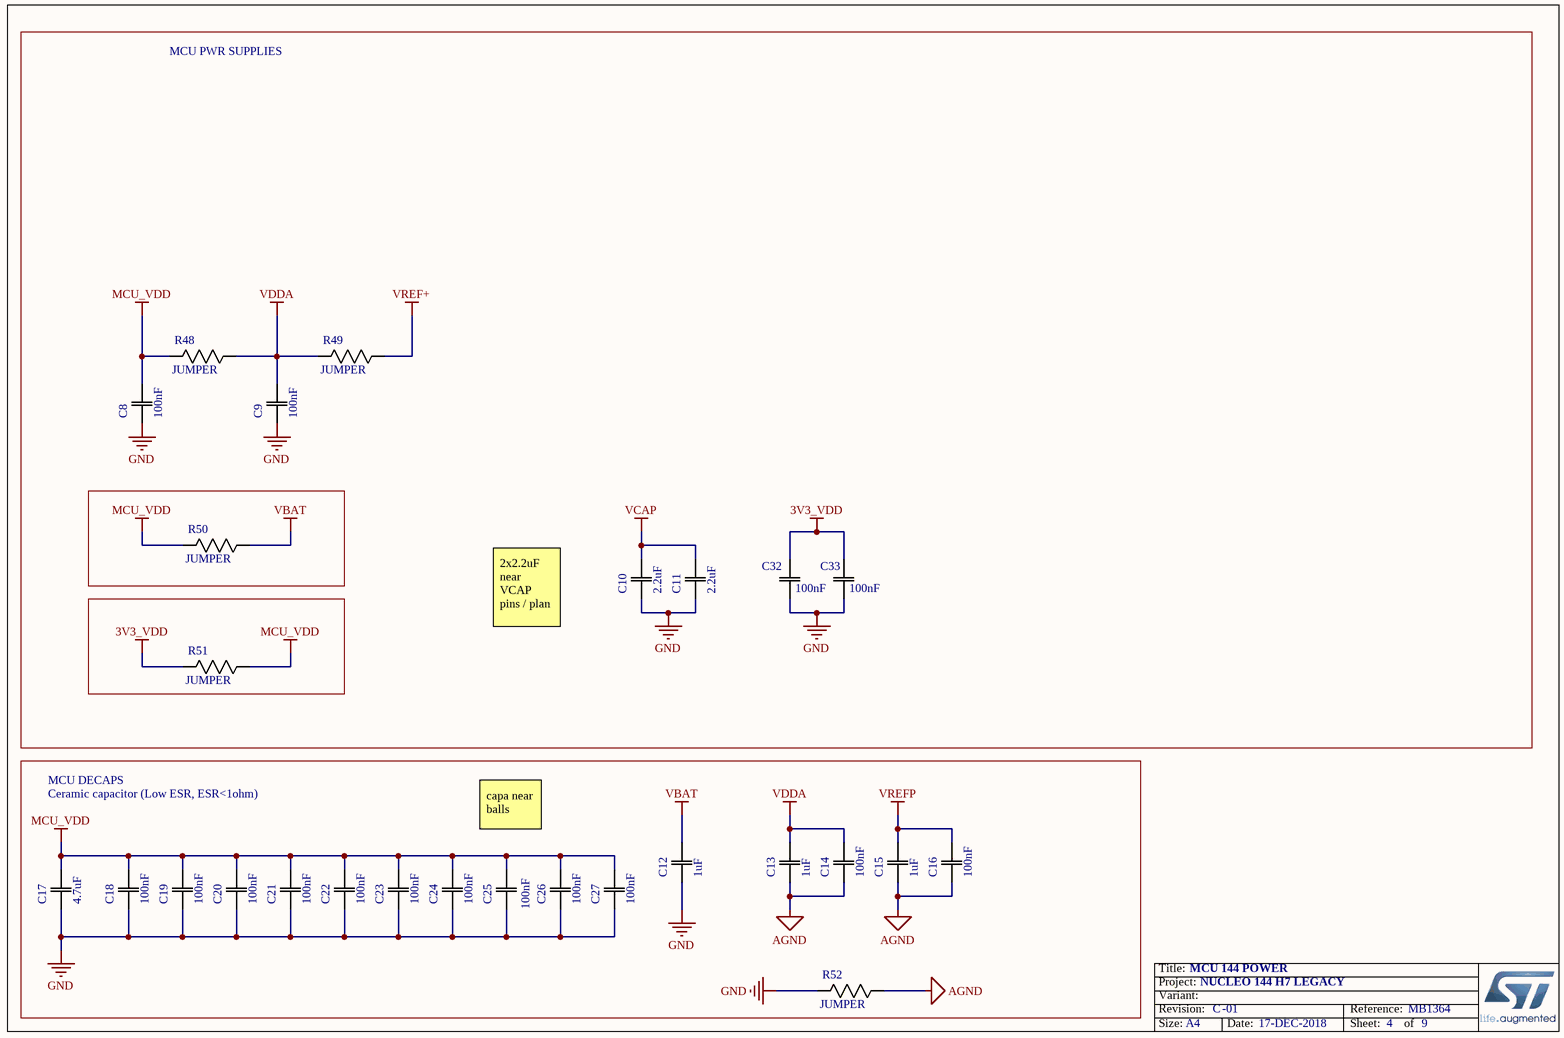
[diagram p4: MCU_144_POWER_Clone.SchDoc]

### Parts
C8  100nF  [0805]
C9  100nF  [0805]
C10  2.2uF  [0805]
C11  2.2uF  [0805]
C12  1uF  [0805]
C13  1uF  [0805]
C14  100nF  [0805]
C15  1uF  [0805]
C16  100nF  [0805]
C17  4.7uF  [0805]
C18  100nF  [0805]
C19  100nF  [0805]
C20  100nF  [0805]
C21  100nF  [0805]
C22  100nF  [0805]
C23  100nF  [0805]
C24  100nF  [0805]
C25  100nF  [0805]
C26  100nF  [0805]
C27  100nF  [0805]
C32  100nF  [0805]
C33  100nF  [0805]
R48  JUMPER  [0805]
R49  JUMPER  [0805]
R50  JUMPER  [0805]
R51  JUMPER  [0805]
R52  JUMPER  [0805]

### Blocks framed on the sheet
MCU PWR SUPPLIES: C8-C11 C32 C33 R48-R51

### Nets
3V3_VDD: C32.2(C2) C33.2(C2) R51.2(R2)
AGND: C13.1(C1) C14.1(C1) C15.1(C1) C16.1(C1) R52.1(R1)
GND: C8.1(C1) C9.1(C1) C10.1(C1) C11.1(C1) C12.1(C1) C17.1(C1) C18.1(C1) C19.1(C1) C20.1(C1) C21.1(C1) C22.1(C1) C23.1(C1) C24.1(C1) C25.1(C1) C26.1(C1) C27.1(C1) C32.1(C1) C33.1(C1) R52.2(R2)
MCU_VDD: C8.2(C2) C17.2(C2) C18.2(C2) C19.2(C2) C20.2(C2) C21.2(C2) C22.2(C2) C23.2(C2) C24.2(C2) C25.2(C2) C26.2(C2) C27.2(C2) R48.2(R2) R50.2(R2) R51.1(R1)
VBAT: C12.2(C2) R50.1(R1)
VCAP: C10.2(C2) C11.2(C2)
VDDA: C9.2(C2) C13.2(C2) C14.2(C2) R48.1(R1) R49.2(R2)
VREF+: R49.1(R1)
VREFP: C15.2(C2) C16.2(C2)

### Notes on the sheet
- 2x2.2uF near VCAP pins / plan
- MCU DECAPS
- Ceramic capacitor (Low ESR, ESR<1ohm)
- capa near balls
- Title:
- Project:
- Size:
- Revision:
- Variant:
- A4
- -
- Date:
- Reference:
- Sheet:
- of

### Library data of the parts
C8 C9 C14 C16 C18-C27 C32 C33 = CAP 100nF 0805: as C1 on sheet Connectors_Clone; Package: 0805; Price: 0,119 CAD; Value: 100nF; Digikey: 311-1140-1-ND; Digikey Link: https://www.digikey.ca/products/en?keywords=311-1140-1-ND; Rating: 50V
C10 C11 = CAP 2.2uF 0805: as C30 on sheet Power_Board_Clone; Package: 0805; Price: 0,461 CAD; Value: 2.2uF; Digikey: 399-3523-1-ND; Digikey Link: https://www.digikey.ca/products/en?keywords=399-3523-1-ND
C12 C13 C15 = CAP 1uF 0805: as C29 on sheet Power_Board_Clone; Package: 0805; Price: 0,172 CAD; Value: 1uF; Digikey: 1276-1029-1-ND; Digikey Link: https://www.digikey.ca/product-detail/en/samsung-electro-mechanics/CL21B105KBFNNNE/1276-1029-1-ND/3889115; Rating: 50V
C17 = CAP 4.7uF 0805: CAP CER 4.7UF 25V X5R 0805; MP: CL21B475KOFNNNE; MF: Samsung Electro-Mechanics; Tolerance: 10%; Rating: 16V; Temperature Coefficient: X7R; Package: 0805; Price: 0,49 CAD; Value: 4.7uF; Digikey: 1276-2873-1-ND; Digikey Link: https://www.digikey.ca/product-detail/en/samsung-electro-mechanics/CL21B475KOFNNNE/1276-2873-1-ND/3890959
R48-R52 = RES 0 0805: as R1 on sheet Connectors_Clone; Digikey: 311-0.0ARCT-ND; Price: 0.058 CAD; Package: 0805; Digikey Link: https://www.digikey.ca/products/en?keywords=311-0.0ARCT-ND

## Sheet USB_Clone.SchDoc: USB
size A4; Date: Not used; ApprovedBy: Not used; CheckedBy: Not used; Author: Not used; CompanyName: STMicroelectronics; DrawnBy: Not used; Engineer: Not used; Organization: Not used; Address1: Not used; Address2: Not used; Address3: Not used; Address4: Not used; DocumentNumber: 7; Revision: Not used; SheetNumber: 7; SheetTotal: 9; CurrentTime: Not used; CurrentDate: Not used; Time: Not used; DocumentFullPathAndName: Not used; DocumentName: Not used; ModifiedDate: Not used; ImagePath: Not used; ProjectName: Not used; Application_BuildNumber: Not used
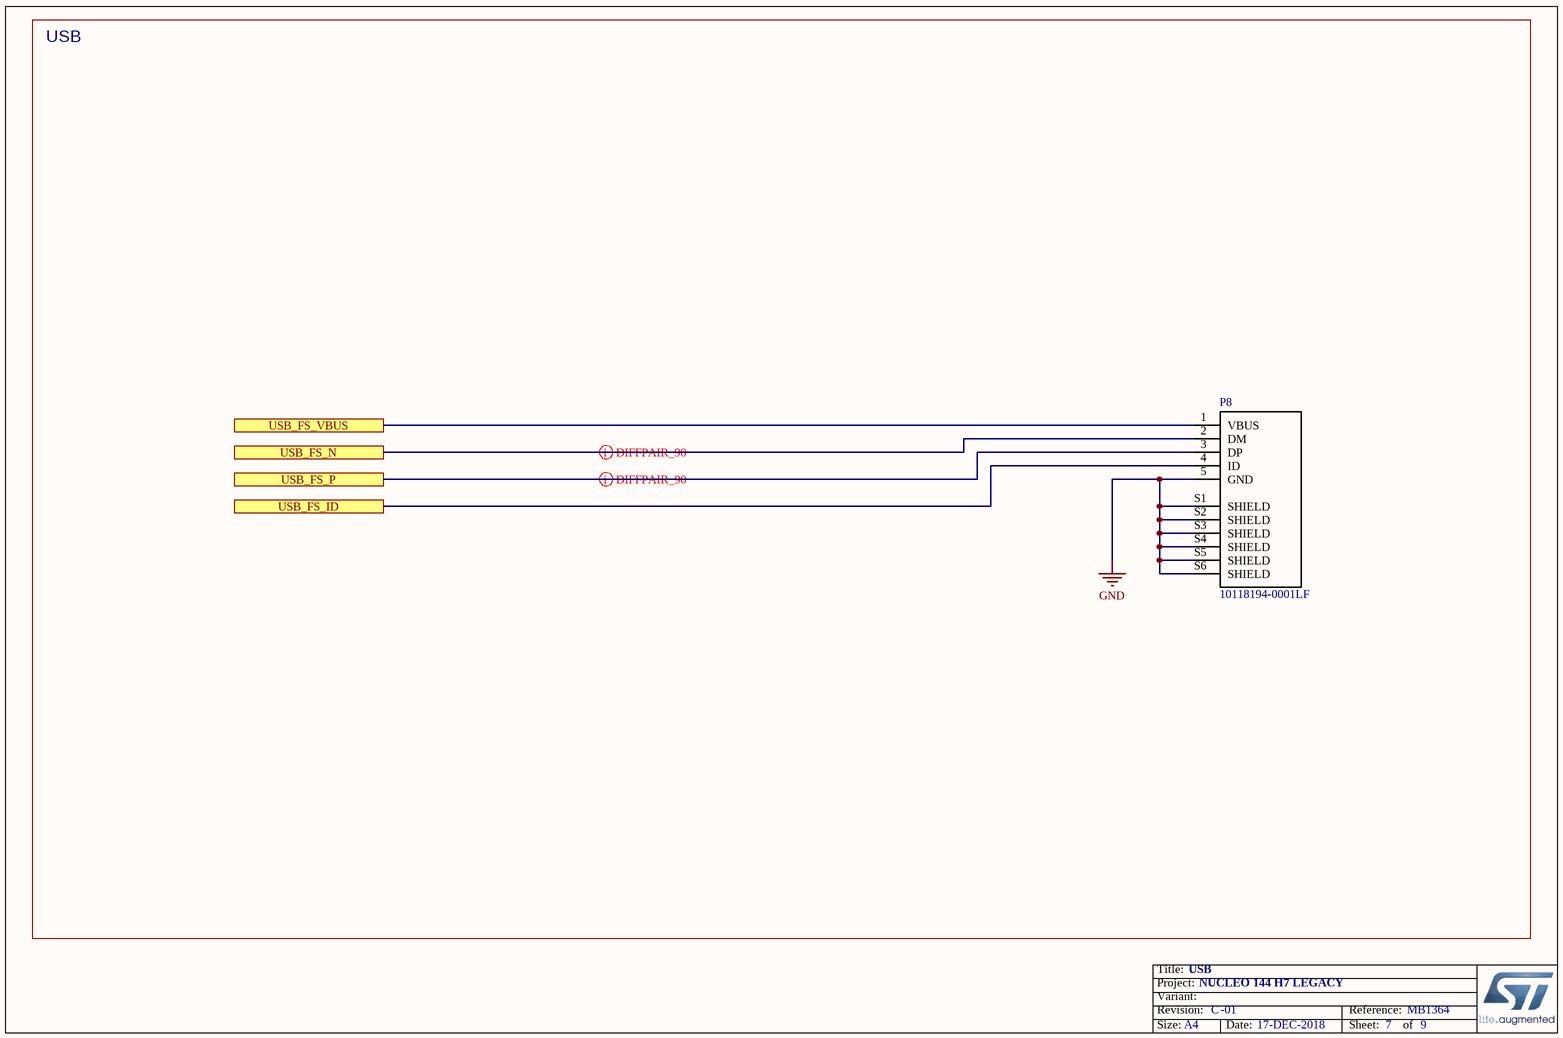
[diagram p5: USB_Clone.SchDoc]

### Parts
(Parts that share a designator on the sheet are numbered #1, #2 ... from top to bottom, then left to right.)
P8#2  10118194-0001LF  [USB Micro B Receptacle]

### Ports
USB_FS_ID, USB_FS_N, USB_FS_P, USB_FS_VBUS

### Nets
GND: P8#2.5(GND) P8#2.S1(SHIELD) P8#2.S2(SHIELD) P8#2.S3(SHIELD) P8#2.S4(SHIELD) P8#2.S5(SHIELD) P8#2.S6(SHIELD)
USB_FS_ID: P8#2.4(ID) ; port USB_FS_ID
USB_FS_N: P8#2.2(DM) ; port USB_FS_N
USB_FS_P: P8#2.3(DP) ; port USB_FS_P
USB_FS_VBUS: P8#2.1(VBUS) ; port USB_FS_VBUS

### Layout directives
differential pair: USB_FS_N, USB_FS_P

### Notes on the sheet
- USB
- Title:
- Project:
- Size:
- Revision:
- Variant:
- A4
- -
- Date:
- Reference:
- Sheet:
- of

### Library data of the parts
P8#2 = USB Micro B Receptacle: USB - micro B USB 2.0 Receptacle Connector 5 Position Surface Mount, Right Angle; Through Hole; MF: Amphenol ICC (FCI); Rating: 100VAC 1.8A; Digikey: 609-4618-1-ND; Digikey Link: https://www.digikey.ca/product-detail/en/amphenol-icc-fci/10118194-0001LF/609-4618-1-ND/2785382; MP: 10118194-0001LF; Price: 0.62000 CAD; ComponentLink1Description: Digikey; ComponentLink1URL: https://www.digikey.ca/product-detail/en/amphenol-icc-fci/10118194-0001LF/609-4618-1-ND/2785382; ComponentLink2Description: Datasheet; ComponentLink2URL: https://www.digikey.ca/en/datasheets/amphenol-fci/amphenol-fci-io-usb-micro

## Nets that join several sheets
3V3: Connectors_Clone (P1.3 P3.16), Power_Board_Clone (5 pins)
3V3_PER: Connectors_Clone (P2.11 P2.12 R9.1 R16.1), Power_Board_Clone (R57.1)
3V3_PWR_BRD: Connectors_Clone (P5.1), Power_Board_Clone (D11.A R60.2)
3V3_VDD: Connectors_Clone (P3.5), Power_Board_Clone (R55.1), MCU_144_IOs_Clone (5 pins), MCU_144_POWER_Clone (C32.2 C33.2 R51.2)
5V: Connectors_Clone (P3.18), Power_Board_Clone (D6.C D7.C)
5V_PWR_BRD: Connectors_Clone (P5.2), Power_Board_Clone (D7.A R54.2)
AGND: Connectors_Clone (C1.1 P4.32 P5.3), MCU_144_IOs_Clone (U1.VSSA), MCU_144_POWER_Clone (5 pins)
GND: Connectors_Clone (21 pins), Power_Board_Clone (11 pins), MCU_144_IOs_Clone (15 pins), MCU_144_POWER_Clone (19 pins), USB_Clone (7 pins)
MCU_VDD: MCU_144_IOs_Clone (U1.VDD), MCU_144_POWER_Clone (15 pins)
VBAT: Connectors_Clone (P3.33), MCU_144_IOs_Clone (U1.VBAT), MCU_144_POWER_Clone (C12.2 R50.1)
VCAP: MCU_144_IOs_Clone (U1.VCAP), MCU_144_POWER_Clone (C10.2 C11.2)
VDDA: MCU_144_IOs_Clone (U1.VDDA), MCU_144_POWER_Clone (5 pins)
VREF+: MCU_144_IOs_Clone (U1.VREF+), MCU_144_POWER_Clone (R49.1)
VREFP: Connectors_Clone (C1.2 R1.1), MCU_144_POWER_Clone (C15.2 C16.2)
BOOT0: Connectors_Clone (P3.7), MCU_144_IOs_Clone (R44.2 U1.BOOT0)
JTDO: Connectors_Clone (P1.8), MCU_144_IOs_Clone (R22.1)
NRST: Connectors_Clone (P1.12 P2.2 P3.14), MCU_144_IOs_Clone (C3.2 S2.2 U1.NRST)
PA0: Connectors_Clone (P3.28), MCU_144_IOs_Clone (R28.2 U1.PA0)
PA1: Connectors_Clone (P3.30), MCU_144_IOs_Clone (R19.1 U1.PA1)
PA2: Connectors_Clone (P4.35), MCU_144_IOs_Clone (R20.1 U1.PA2)
PA3: Connectors_Clone (P4.37), MCU_144_IOs_Clone (U1.PA3)
PA4: Connectors_Clone (P3.32), MCU_144_IOs_Clone (U1.PA4)
PA5: Connectors_Clone (P4.11), MCU_144_IOs_Clone (U1.PA5)
PA6: Connectors_Clone (P4.13), MCU_144_IOs_Clone (U1.PA6)
PA7: Connectors_Clone (P4.15), MCU_144_IOs_Clone (R21.1 U1.PA7)
PA8: Connectors_Clone (P4.23), MCU_144_IOs_Clone (U1.PA8)
PA9: Connectors_Clone (P4.21), MCU_144_IOs_Clone (R23.1 U1.PA9)
PA10: Connectors_Clone (P4.33), MCU_144_IOs_Clone (R25.1 U1.PA10)
PA11: Connectors_Clone (R6.1), MCU_144_IOs_Clone (R27.1 U1.PA11)
PA12: Connectors_Clone (R5.1), MCU_144_IOs_Clone (R29.1 U1.PA12)
PA13: Connectors_Clone (P1.4 P3.13), MCU_144_IOs_Clone (U1.PA13)
PA14: Connectors_Clone (P1.6 P3.15), MCU_144_IOs_Clone (U1.PA14)
PA15: Connectors_Clone (P1.10 P3.17), MCU_144_IOs_Clone (U1.PA15)
PB0: Connectors_Clone (P3.34), MCU_144_IOs_Clone (U1.PB0)
PB1: Connectors_Clone (P4.24), MCU_144_IOs_Clone (U1.PB1)
PB2: Connectors_Clone (P4.22), MCU_144_IOs_Clone (U1.PB2)
PB3: Connectors_Clone (P4.31), MCU_144_IOs_Clone (R22.2 U1.PB3)
PB4: Connectors_Clone (P4.27), MCU_144_IOs_Clone (U1.PB4)
PB5: Connectors_Clone (P4.29), MCU_144_IOs_Clone (U1.PB5)
PB7: Connectors_Clone (P3.21), MCU_144_IOs_Clone (U1.PB7)
PB8: Connectors_Clone (P4.3), MCU_144_IOs_Clone (U1.PB8)
PB10: Connectors_Clone (P4.25), MCU_144_IOs_Clone (U1.PB10)
PB11: Connectors_Clone (P4.18), MCU_144_IOs_Clone (U1.PB11)
PB12: Connectors_Clone (P4.16), MCU_144_IOs_Clone (U1.PB12)
PB13: Connectors_Clone (P4.30), MCU_144_IOs_Clone (R30.2 U1.PB13)
PB14: Connectors_Clone (P4.28 R17.2), MCU_144_IOs_Clone (U1.PB14)
PB15: Connectors_Clone (P4.26), MCU_144_IOs_Clone (U1.PB15)
PC0: Connectors_Clone (P3.38), MCU_144_IOs_Clone (U1.PC0)
PC1: Connectors_Clone (P3.36), MCU_144_IOs_Clone (R32.1 U1.PC1)
PC2: Connectors_Clone (P3.35), MCU_144_IOs_Clone (U1.PC2)
PC3: Connectors_Clone (P3.37), MCU_144_IOs_Clone (U1.PC3)
PC4: Connectors_Clone (P4.34), MCU_144_IOs_Clone (R33.1 U1.PC4)
PC5: Connectors_Clone (P4.6), MCU_144_IOs_Clone (R34.1 U1.PC5)
PC6: Connectors_Clone (P4.4), MCU_144_IOs_Clone (U1.PC6)
PC7: Connectors_Clone (P4.19), MCU_144_IOs_Clone (U1.PC7)
PC8: Connectors_Clone (R3.1), MCU_144_IOs_Clone (U1.PC8)
PC9: Connectors_Clone (R2.2), MCU_144_IOs_Clone (U1.PC9)
PC10: Connectors_Clone (P3.1), MCU_144_IOs_Clone (U1.PC10)
PC11: Connectors_Clone (P3.2), MCU_144_IOs_Clone (U1.PC11)
PC12: Connectors_Clone (P3.3), MCU_144_IOs_Clone (U1.PC12)
PC13: Connectors_Clone (P3.23), MCU_144_IOs_Clone (R24.2 U1.PC13)
PC14: Connectors_Clone (P3.25), MCU_144_IOs_Clone (R35.2)
PC15: Connectors_Clone (P3.27), MCU_144_IOs_Clone (R36.2)
PD0: Connectors_Clone (P6.19), MCU_144_IOs_Clone (U1.PD0)
PD1: Connectors_Clone (P6.17), MCU_144_IOs_Clone (U1.PD1)
PD2: Connectors_Clone (P3.4), MCU_144_IOs_Clone (U1.PD2)
PD3: Connectors_Clone (P6.2), MCU_144_IOs_Clone (U1.PD3)
PD4: Connectors_Clone (P6.1), MCU_144_IOs_Clone (U1.PD4)
PD5: Connectors_Clone (P6.3), MCU_144_IOs_Clone (U1.PD5)
PD6: Connectors_Clone (P6.5), MCU_144_IOs_Clone (U1.PD6)
PD7: Connectors_Clone (P6.7), MCU_144_IOs_Clone (U1.PD7)
PD8: Connectors_Clone (R4.1), MCU_144_IOs_Clone (U1.PD8)
PD9: Connectors_Clone (R7.2), MCU_144_IOs_Clone (U1.PD9)
PD10: Connectors_Clone (P7.27), MCU_144_IOs_Clone (U1.PD10)
PD11: Connectors_Clone (P7.7), MCU_144_IOs_Clone (U1.PD11)
PD12: Connectors_Clone (P7.5), MCU_144_IOs_Clone (U1.PD12)
PD13: Connectors_Clone (P7.3), MCU_144_IOs_Clone (U1.PD13)
PD14: Connectors_Clone (P7.8), MCU_144_IOs_Clone (U1.PD14)
PD15: Connectors_Clone (P7.10), MCU_144_IOs_Clone (U1.PD15)
PE0: Connectors_Clone (P7.26), MCU_144_IOs_Clone (U1.PE0)
PE1: Connectors_Clone (P6.23 R12.2), MCU_144_IOs_Clone (U1.PE1)
PE2: Connectors_Clone (P6.8), MCU_144_IOs_Clone (U1.PE2)
PE3: Connectors_Clone (P6.9), MCU_144_IOs_Clone (U1.PE3)
PE4: Connectors_Clone (P6.10), MCU_144_IOs_Clone (U1.PE4)
PE5: Connectors_Clone (P6.12), MCU_144_IOs_Clone (U1.PE5)
PE6: Connectors_Clone (P6.24), MCU_144_IOs_Clone (U1.PE6)
PE7: Connectors_Clone (P7.6), MCU_144_IOs_Clone (U1.PE7)
PE8: Connectors_Clone (P7.2), MCU_144_IOs_Clone (U1.PE8)
PE9: Connectors_Clone (P7.14), MCU_144_IOs_Clone (U1.PE9)
PE10: Connectors_Clone (P7.9), MCU_144_IOs_Clone (U1.PE10)
PE11: Connectors_Clone (P7.18), MCU_144_IOs_Clone (U1.PE11)
PE12: Connectors_Clone (P7.11), MCU_144_IOs_Clone (U1.PE12)
PE13: Connectors_Clone (P7.17), MCU_144_IOs_Clone (U1.PE13)
PE14: Connectors_Clone (P7.13), MCU_144_IOs_Clone (U1.PE14)
PE15: Connectors_Clone (P7.15), MCU_144_IOs_Clone (U1.PE15)
PF0: Connectors_Clone (P6.15), MCU_144_IOs_Clone (U1.PF0)
PF1: Connectors_Clone (P6.13), MCU_144_IOs_Clone (U1.PF1)
PF2: Connectors_Clone (P6.14), MCU_144_IOs_Clone (U1.PF2)
PF3: Connectors_Clone (P7.20), MCU_144_IOs_Clone (U1.PF3)
PF4: Connectors_Clone (P4.38), MCU_144_IOs_Clone (U1.PF4)
PF5: Connectors_Clone (P4.36), MCU_144_IOs_Clone (U1.PF5)
PF6: Connectors_Clone (P3.9), MCU_144_IOs_Clone (U1.PF6)
PF7: Connectors_Clone (P3.11), MCU_144_IOs_Clone (U1.PF7)
PF8: Connectors_Clone (P6.16), MCU_144_IOs_Clone (U1.PF8)
PF9: Connectors_Clone (P6.18), MCU_144_IOs_Clone (U1.PF9)
PF10: Connectors_Clone (P7.4), MCU_144_IOs_Clone (U1.PF10)
PF11: Connectors_Clone (P7.24), MCU_144_IOs_Clone (U1.PF11)
PF12: Connectors_Clone (P7.21), MCU_144_IOs_Clone (U1.PF12)
PF13: Connectors_Clone (P7.19), MCU_144_IOs_Clone (U1.PF13)
PF14: Connectors_Clone (P7.12), MCU_144_IOs_Clone (U1.PF14)
PF15: Connectors_Clone (P7.22), MCU_144_IOs_Clone (U1.PF15)
PG0: Connectors_Clone (P6.21), MCU_144_IOs_Clone (U1.PG0)
PG1: Connectors_Clone (P6.20), MCU_144_IOs_Clone (U1.PG1)
PG2: Connectors_Clone (P6.4), MCU_144_IOs_Clone (U1.PG2)
PG3: Connectors_Clone (P6.6), MCU_144_IOs_Clone (U1.PG3)
PG4: Connectors_Clone (P7.31), MCU_144_IOs_Clone (U1.PG4)
PG5: Connectors_Clone (P7.30), MCU_144_IOs_Clone (U1.PG5)
PG6: Connectors_Clone (P7.32), MCU_144_IOs_Clone (U1.PG6)
PG7: Connectors_Clone (P7.29), MCU_144_IOs_Clone (U1.PG7)
PG8: Connectors_Clone (P7.28), MCU_144_IOs_Clone (U1.PG8)
PG9: Connectors_Clone (P6.25), MCU_144_IOs_Clone (U1.PG9)
PG10: Connectors_Clone (P6.28), MCU_144_IOs_Clone (U1.PG10)
PG11: Connectors_Clone (P6.32), MCU_144_IOs_Clone (R41.1 U1.PG11)
PG12: Connectors_Clone (P6.27), MCU_144_IOs_Clone (U1.PG12)
PG13: Connectors_Clone (P6.30), MCU_144_IOs_Clone (R43.1 U1.PG13)
PG14: Connectors_Clone (P7.23), MCU_144_IOs_Clone (U1.PG14)
PG15: Connectors_Clone (P6.26), MCU_144_IOs_Clone (U1.PG15)
PH0: Connectors_Clone (P3.29), MCU_144_IOs_Clone (R39.1)
PH1: Connectors_Clone (P3.31), MCU_144_IOs_Clone (R40.1)
RMII_CRS_DV: Connectors_Clone (P2.8), MCU_144_IOs_Clone (R21.2)
RMII_MDC: Connectors_Clone (P2.10), MCU_144_IOs_Clone (R32.2)
RMII_MDIO: Connectors_Clone (P2.9), MCU_144_IOs_Clone (R20.2)
RMII_REF_CLK: Connectors_Clone (P2.7), MCU_144_IOs_Clone (R19.2)
RMII_RXD0: Connectors_Clone (P2.5), MCU_144_IOs_Clone (R33.2)
RMII_RXD1: Connectors_Clone (P2.6), MCU_144_IOs_Clone (R34.2)
RMII_TX_EN: Connectors_Clone (P2.3), MCU_144_IOs_Clone (R41.2)
RMII_TXD0: Connectors_Clone (P2.4), MCU_144_IOs_Clone (R43.2)
RMII_TXD1: Connectors_Clone (P2.1), MCU_144_IOs_Clone (R30.1)
USB_FS_ID: MCU_144_IOs_Clone (R25.2), USB_Clone (P8#2.4)
USB_FS_N: MCU_144_IOs_Clone (R27.2), USB_Clone (P8#2.2)
USB_FS_P: MCU_144_IOs_Clone (R29.2), USB_Clone (P8#2.3)
USB_FS_VBUS: Power_Board_Clone (F1.1), MCU_144_IOs_Clone (R23.2), USB_Clone (P8#2.1)